# Altium project SpaceLiin_Satellite_4U_Laser_Internal_External_V1.0.0.PrjPcb
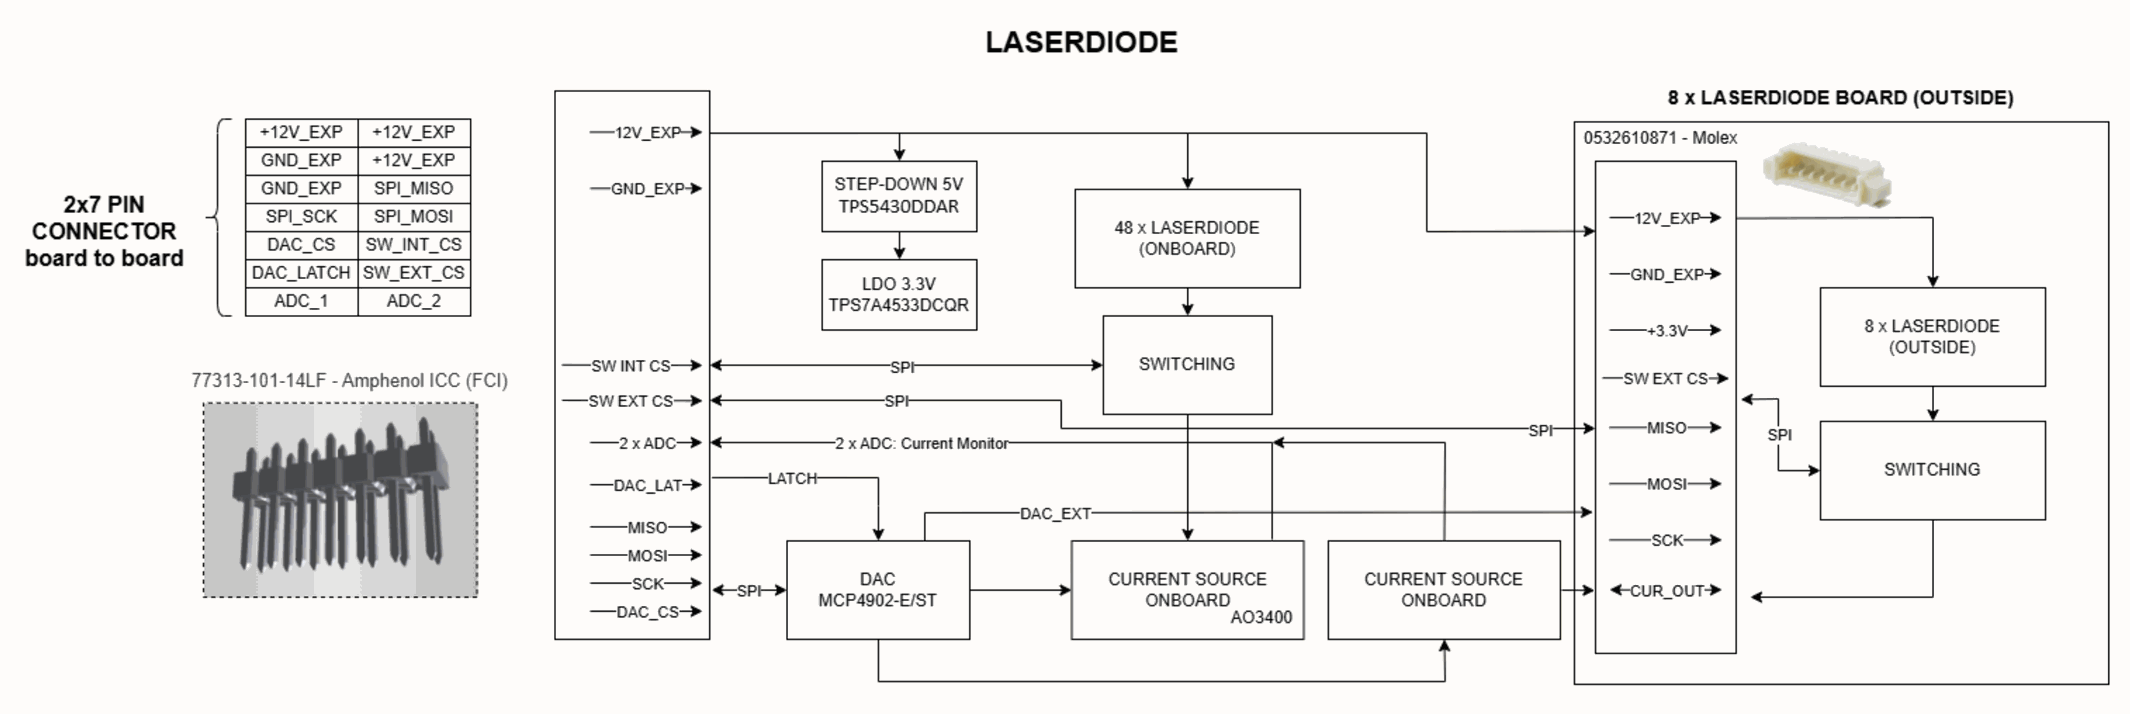
[diagram p0: 2_BLOCK_DIAGRAM.SchDoc]
6 sheets, 330 parts. Net scope: global (net labels, ports and power ports of the same name join across sheets).
Board files: LASER.PcbDoc, SpaceLiin_Satellite_4U_Laser_Internal_External_V1.0.0.PcbDoc
Sheets:
  2_BLOCK_DIAGRAM.SchDoc
  3_POWER SWITCH AND LDO.SchDoc
  4_COMMUNICATION.SchDoc
  5_CURRENT_SOURCE.SchDoc
  6_SWITCHING.SchDoc
  MOUNTING.SchDoc

## Sheet 2_BLOCK_DIAGRAM.SchDoc
size 420 x 297 mm; SheetNumber: 6; SheetTotal: 5

### Notes on the sheet
- Project:
- Sub-system:
- Design by:
- Sheet title:
- Sheet
- A3
- of
- Checked by:
- Approved by:
- Revision:
- Document No:
- Size:
- Date:

## Sheet 3_POWER SWITCH AND LDO.SchDoc
size 420 x 297 mm; SheetNumber: 3; SheetTotal: 7
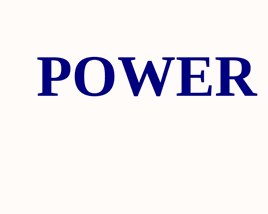
[diagram p1: 3_POWER SWITCH AND LDO.SchDoc, top left]
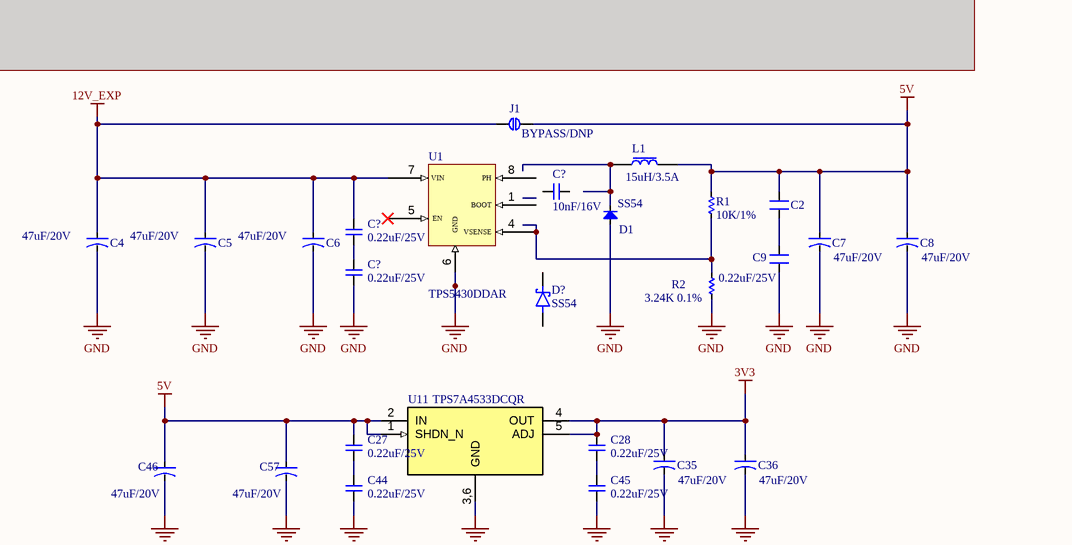
[diagram p2: 3_POWER SWITCH AND LDO.SchDoc, top right]
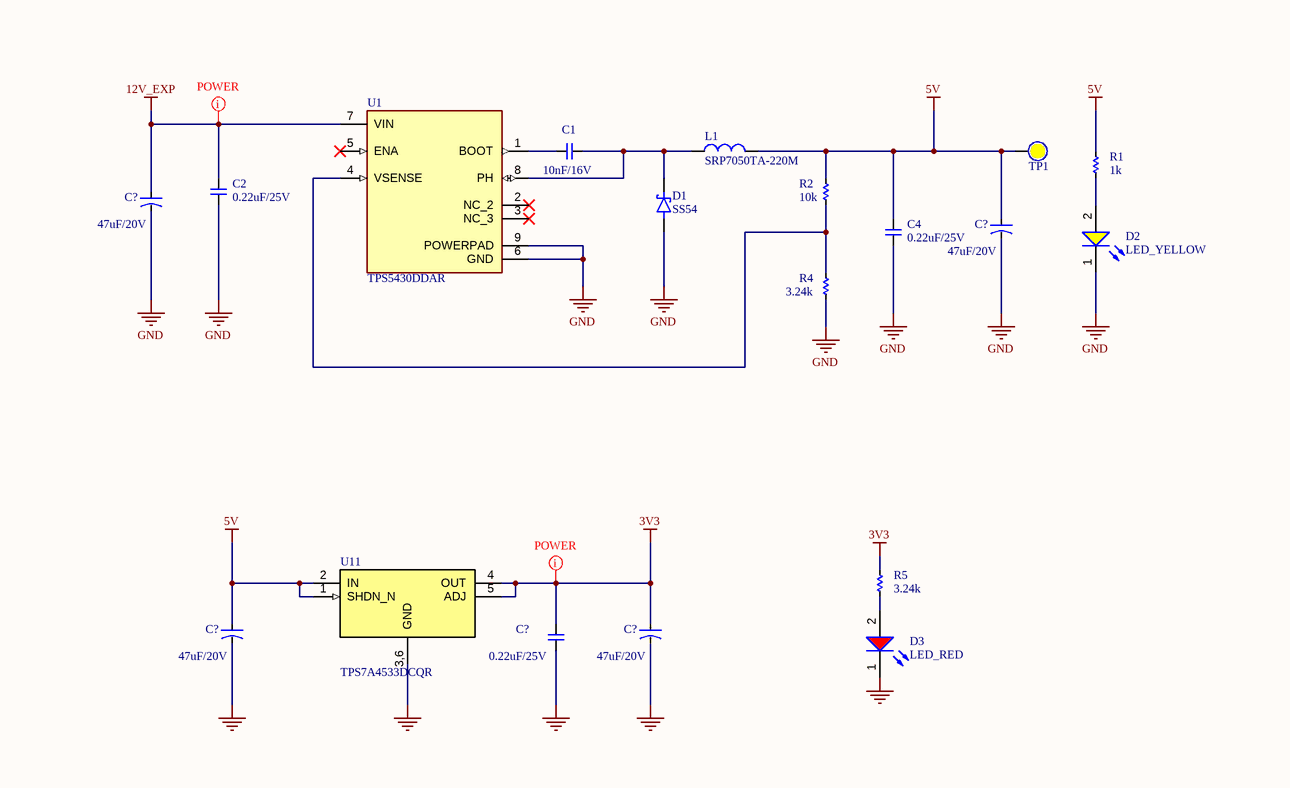
[diagram p3: 3_POWER SWITCH AND LDO.SchDoc, bottom right]

### Parts
(Parts that share a designator on the sheet are numbered #1, #2 ... from top to bottom, then left to right.)
C1  10nF/16V  [CAP_C_1005X50_L]
C2#1  0.22uF/25V  [SM-0603]  (value not drawn)
C2#2  0.22uF/25V  [CAP_C_1608X80]
C4#1  47uF/20V  [CAP TANT 2312]
C4#2  0.22uF/25V  [CAP_C_1608X80]
C5  47uF/20V  [CAP TANT 2312]
C6  47uF/20V  [CAP TANT 2312]
C7  47uF/20V  [CAP TANT 2312]
C8  47uF/20V  [CAP TANT 2312]
C9#1  0.22uF/25V  [SM-0603]
C27  0.22uF/25V  [CAP_C_1608X80]
C28  0.22uF/25V  [CAP_C_1608X80]
C35  47uF/20V  [CAP TANT 2312]
C36  47uF/20V  [CAP TANT 2312]
C44#1  0.22uF/25V  [CAP_C_1608X80]
C45  0.22uF/25V  [CAP_C_1608X80]
C46  47uF/20V  [CAP TANT 2312]
C57  47uF/20V  [CAP TANT 2312]
C?#1  10nF/16V  [CAP_C_1608X80]
C?#2  0.22uF/25V  [CAP_C_1608X80]
C?#3  0.22uF/25V  [CAP_C_1608X80]
C?#4  47uF/20V  [CAP TANT 2312]
C?#5  47uF/20V  [CAP TANT 2312]
C?#6  47uF/20V  [CAP TANT 2312]
C?#7  47uF/20V  [CAP TANT 2312]
C?#8  0.22uF/25V  [CAP_C_1608X80]
D1#1  SS54  [DIO-SMD-A]
D1#2  SS54  [DO-214AC_SMA]
D2  LED_YELLOW  [LED_0603]
D3  LED_RED  [LED_0603]
D?  SS54  [DO-214AC_SMA]
J1#1  BYPASS/DNP  [BIG_CONNECTOR]
L1#1  15uH/3.5A  [SRP7050TA]
L1#2  SRP7050TA-220M  [PSM6050]
R1#1  10K/1%  [RES-SMD-0603]
R1#2  1k  [RES_C_1005X40]
R2#1  3.24K 0.1%  [RES-SMD-0603]
R2#2  10k  [RES_C_1005x30_L]
R4  3.24k  [RES_C_1005x30_L]
R5  3.24k  [RES_C_1005X40]
TP1  (no value)  [Testpoint_50]  (no BOM)
U1#1  TPS5430DDAR  [HSOP8]
U1#2  TPS5430DDAR  [CONV_TPS5430DDAR]
U11#1  TPS7A4533DCQR  [SOT223-6]
U11#2  TPS7A4533DCQR  [SOT223-6]

### Nets
3V3: C28.2 C35.1 C36.1 C?#7.1 C?#8.2 R5.2 U11#1.4(OUT) U11#1.5(ADJ) U11#2.4(OUT) U11#2.5(ADJ)
5V: C2#1.2 C4#2.2 C7.1 C8.1 C27.2 C46.1 C57.1 C?#5.1 C?#6.1 J1#1.2 L1#1.2 L1#2.2 R1#1.2 R1#2.2 R2#2.2 TP1.1 U11#1.1(SHDN_N) U11#1.2(IN) U11#2.1(SHDN_N) U11#2.2(IN)
12V_EXP: C2#2.2 C4#1.1 C5.1 C6.1 C?#2.2 C?#4.1 J1#1.1 U1#1.7(VIN) U1#2.7(VIN)
GND: C2#2.1 C4#1.2 C4#2.1 C5.2 C6.2 C7.2 C8.2 C9#1.1 C35.2 C36.2 C44#1.1 C45.1 C46.2 C57.2 C?#3.1 C?#4.2 C?#5.2 C?#6.2 C?#7.2 C?#8.1 D1#1.1(A) D1#2.2(A) D2.1(K) D3.1(K) R2#1.1 R4.1 U1#1.6(GND) U1#2.6(GND) U1#2.9(POWERPAD) U11#1.3,6(GND) U11#2.3,6(GND)
NetC1_1: C1.1 D1#2.1(K) L1#2.1 U1#2.8(PH)
NetC1_2: C1.2 U1#2.1(BOOT)
NetC2#1_1: C2#1.1 C9#1.2
NetC27_1: C27.1 C44#1.2
NetC28_1: C28.1 C45.2
NetC?#2_1: C?#2.1 C?#3.2
NetD1#1_2: D1#1.2(K) L1#1.1
NetD2_2: D2.2(A) R1#2.1
NetD3_2: D3.2(A) R5.1
NetR1#1_1: R1#1.1 R2#1.2 U1#1.4(VSENSE)
NetR2#2_1: R2#2.1 R4.2 U1#2.4(VSENSE)

Not connected (* = marked no-connect by the designer): C?#1 1 2; D? 1(K) 2(A); U1#1 1(BOOT) 5(EN)* 8(PH); U1#2 2(NC_2)* 3(NC_3)* 5(ENA)*

### Layout directives
net class POWER: 3V3, 12V_EXP

### Notes on the sheet
- POWER SWITCH AND LDO
- Project:
- Sub-system:
- Design by:
- Sheet title:
- Sheet
- A3
- of
- Checked by:
- Approved by:
- Revision:
- Document No:
- Size:
- Date:

### Library data of the parts
C1 C2#2 C4#2 C27 C28 C44#1 C45 C?#1-C?#3 C?#8 = _CAP_C_2: CAP
C2#1 C9#1 = CM: CL10B224KA8NNNC; Value: 103
C4#1 C5-C8 C35 C36 C46 C57 C?#4-C?#7 = CN-ALU-SMD: TAJC476K020RNJ; Published: 8-Jun-2000; LatestRevisionDate: 17-Jul-2002; LatestRevisionNote: Re-released for DXP Platform.; PackageReference: POLAR0.8; Publisher: Altium Limited
D1#1 = Diode SMD: Code - JEDEC: DO-214-AB; Value: 1N5007; Published: 8-Jun-2000; Revision: July-2002: Re-released for DXP Platform.; Publisher: Altium Limited
D1#2 D? = DIODE SCHOTTKY
J1#1 = CNT: DNP
L1#1 = INDUCTOR: SRP7050TA-150M
L1#2 = SRP7050TA-220M: FIXED IND 22UH 2.5A 170 MOHM SMD
R1#1 = Res-SMD: ERJ-3EKF1002V; Manufacturer: Generic Components; Class: Passive; Published: 08/06/2000; Publisher: Altium Hobart Technology Centre
R1#2 R2#2 R4 R5 = _RES_B_2: RES
R2#1 = Res-SMD: ERJ-3EKF3241V; Manufacturer: Generic Components; Class: Passive; Published: 08/06/2000; Publisher: Altium Hobart Technology Centre
TP1 = Test Point: Solder: NF
U1#1 = TPS543X: pin to pad: 6>6+9
U1#2 = TPS5430DDAR: 5.5V to 36V Input, 3A, 500kHz Step-Down Converter; MF: Texas Instruments; Package: HSOIC-8 Texas Instruments; Check_prices: https://www.snapeda.com/parts/TPS5430DDAR/Texas+Instruments/view-part/?ref=eda; Value: *; Purchase-URL: https://pricing.snapeda.com/search/part/TPS5430DDAR/?ref=eda; Availability: In Stock; SnapEDA_Link: https://www.snapeda.com/parts/TPS5430DDAR/Texas+Instruments/view-part/?ref=snap; MP: TPS5430DDAR; Price: None

## Sheet 4_COMMUNICATION.SchDoc
size 420 x 297 mm; SheetNumber: 4; SheetTotal: 7
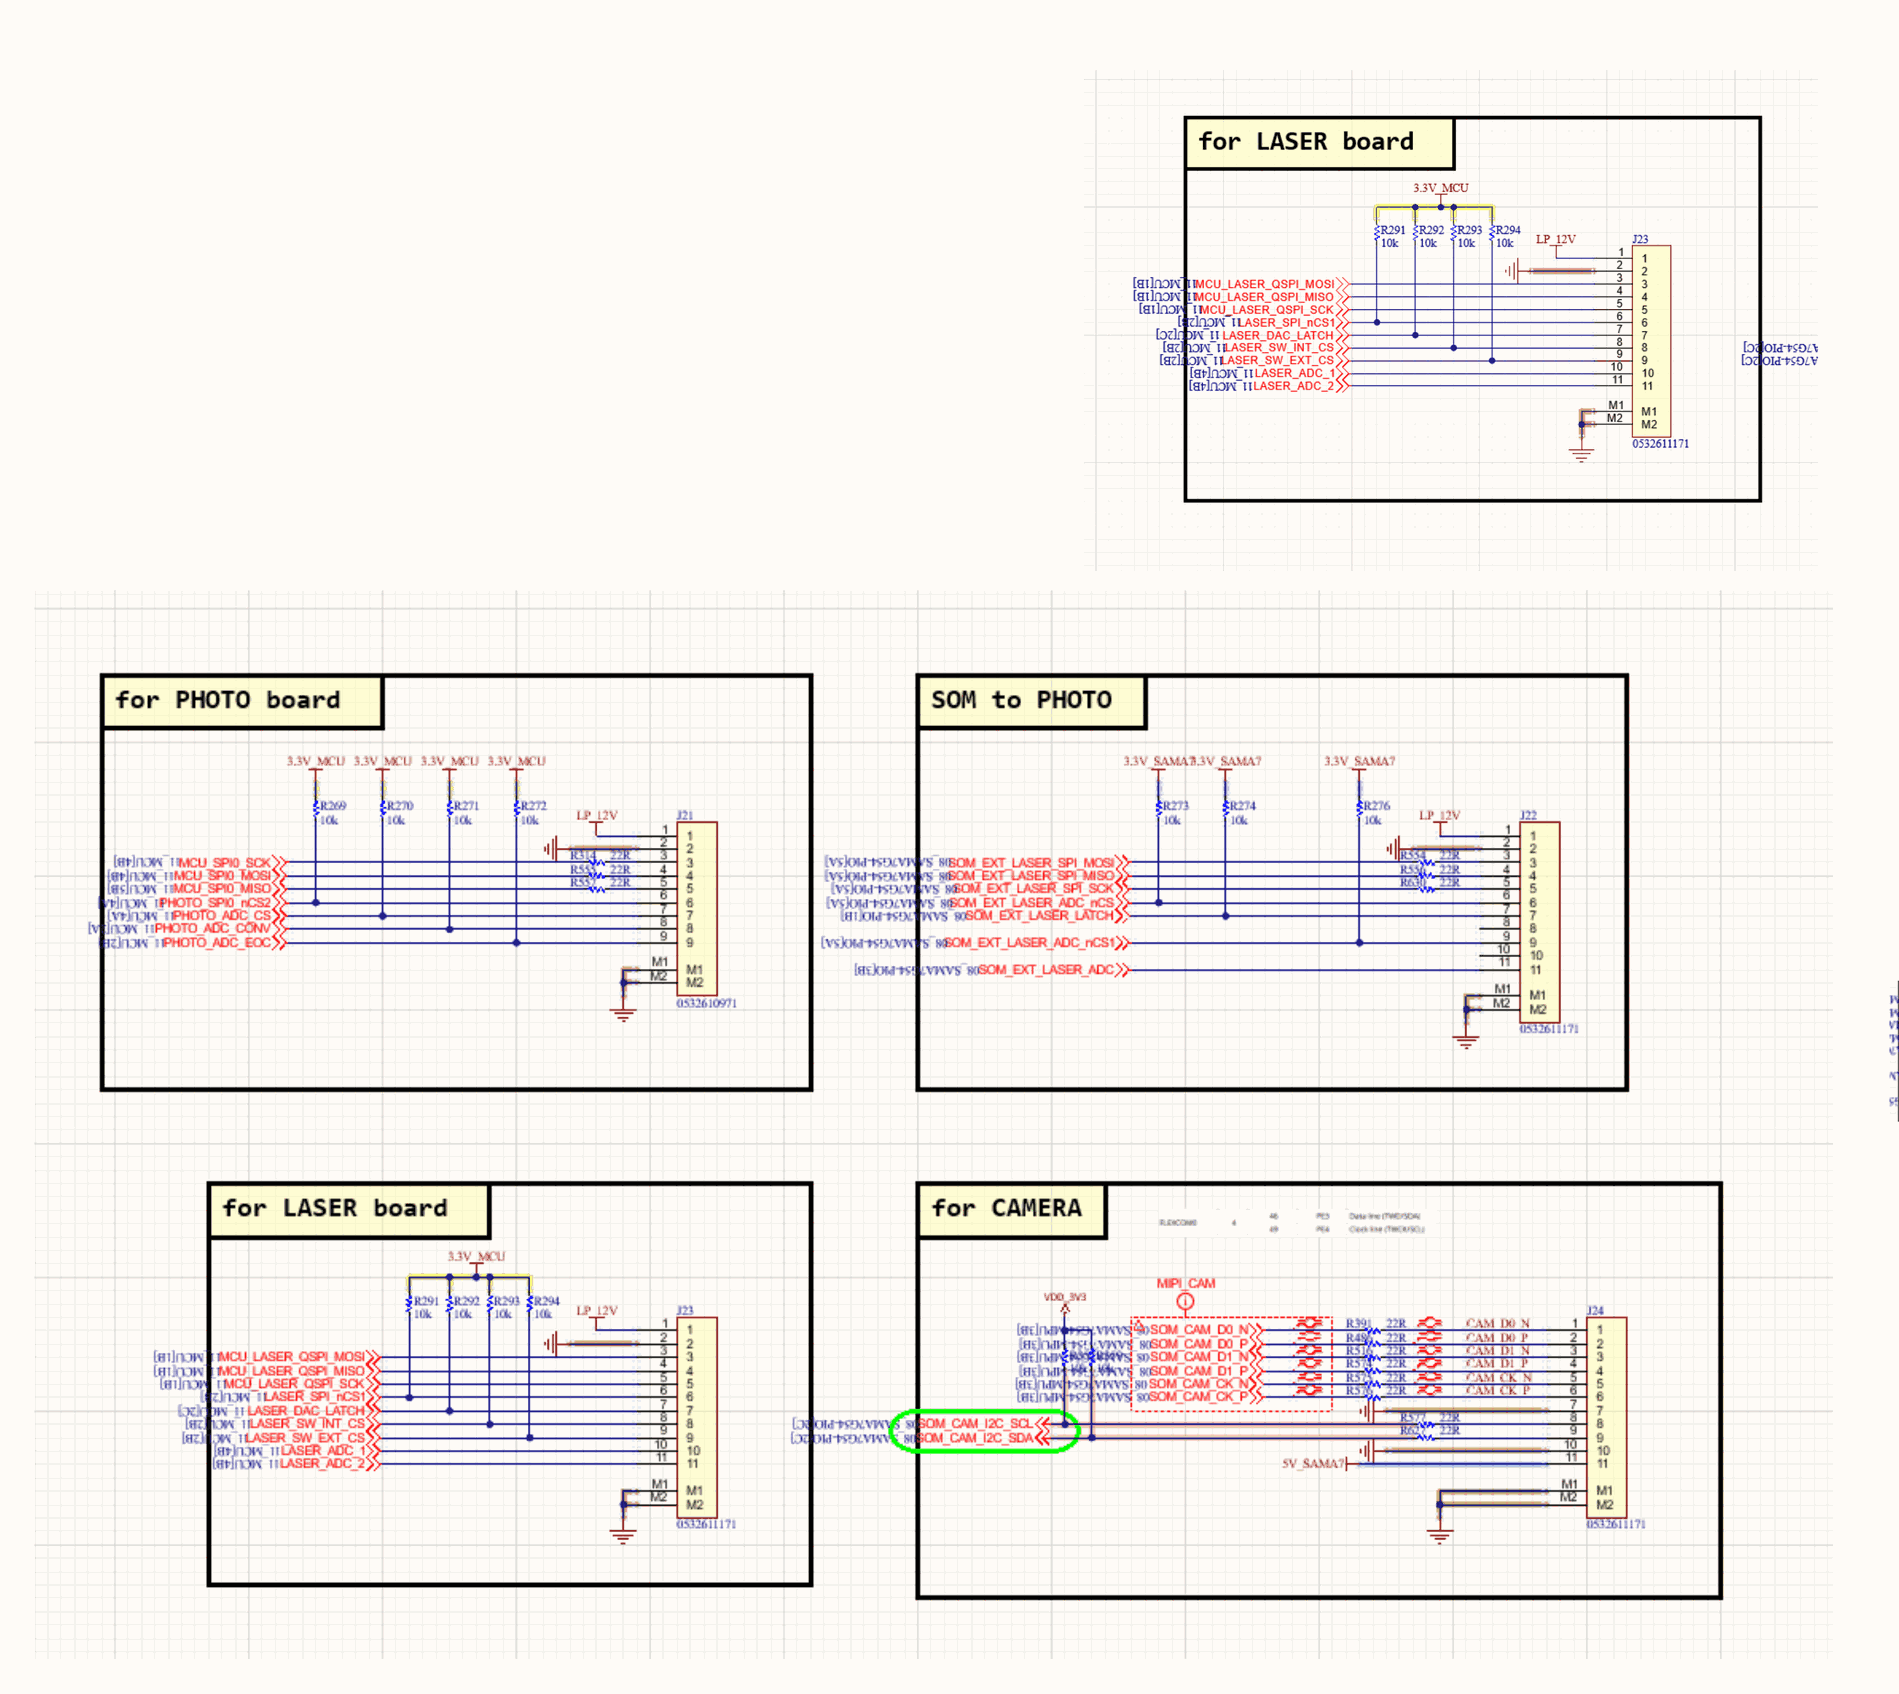
[diagram p4: 4_COMMUNICATION.SchDoc, left]
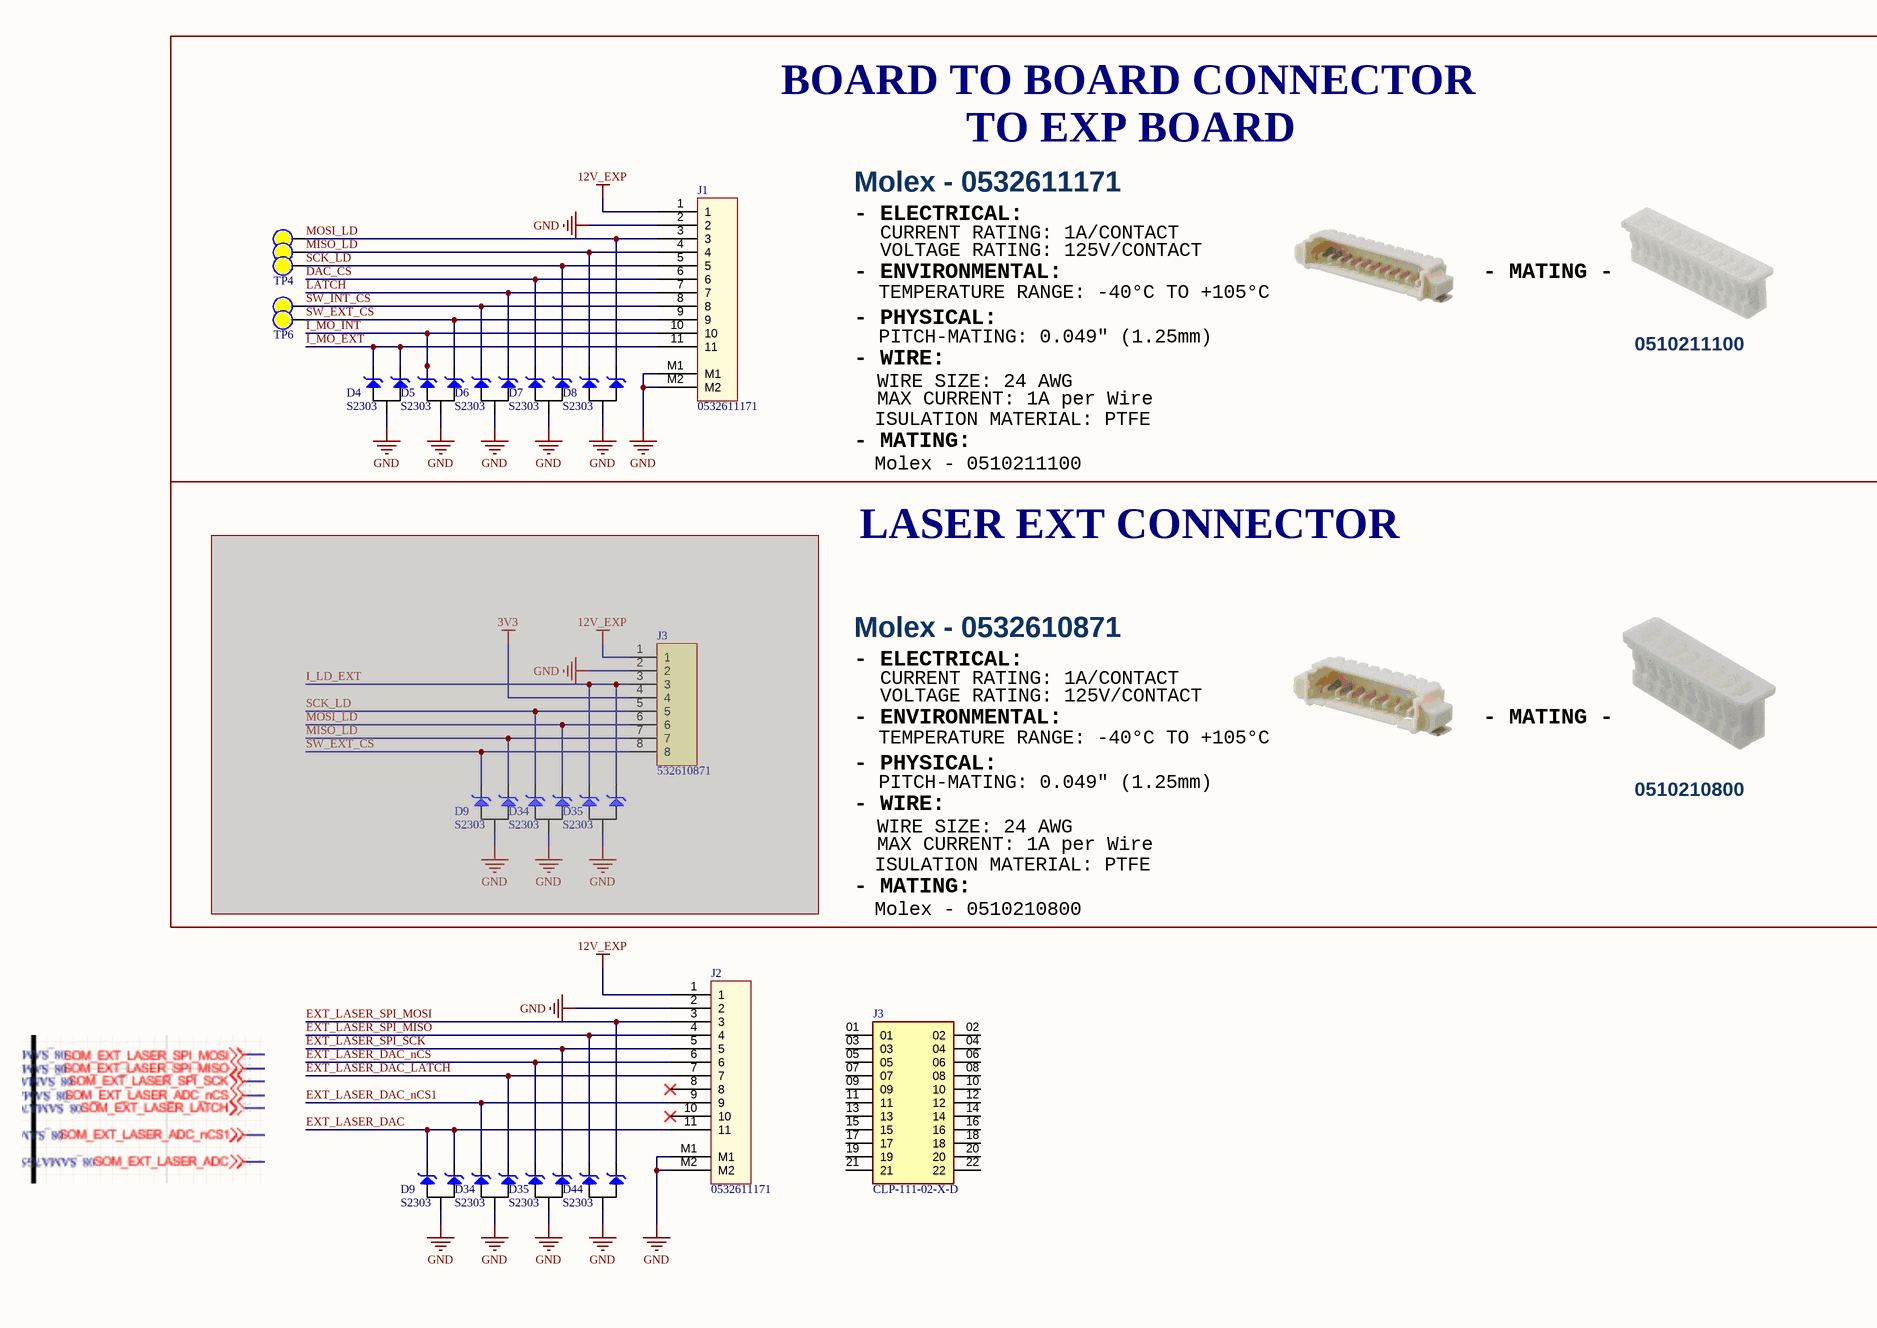
[diagram p5: 4_COMMUNICATION.SchDoc, right]

### Parts
(Parts that share a designator on the sheet are numbered #1, #2 ... from top to bottom, then left to right.)
D4  S2303  [SOT23-3-132]
D5  S2303  [SOT23-3-132]
D6  S2303  [SOT23-3-132]
D7  S2303  [SOT23-3-132]
D8  S2303  [SOT23-3-132]
D9#1  S2303  [SOT23-3-132]  (masked out: inside a compile mask, not in the netlist)
D9#2  S2303  [SOT23-3-132]
D34#1  S2303  [SOT23-3-132]  (masked out: inside a compile mask, not in the netlist)
D34#2  S2303  [SOT23-3-132]
D35#1  S2303  [SOT23-3-132]  (masked out: inside a compile mask, not in the netlist)
D35#2  S2303  [SOT23-3-132]
D44  S2303  [SOT23-3-132]
J1#2  0532611171  [MOLEX_0532611171]
J2  0532611171  [MOLEX_0532611171]
J3#1  532610871  [MOLEX_0532610871]  (masked out: inside a compile mask, not in the netlist)
J3#2  CLP-111-02-X-D  [SAMTEC_CLP-111-02-X-D]
TP2  (no value)  [Testpoint_50]  (no BOM)
TP3  (no value)  [Testpoint_50]  (no BOM)
TP4  (no value)  [Testpoint_50]  (no BOM)
TP5  (no value)  [Testpoint_50]  (no BOM)
TP6  (no value)  [Testpoint_50]  (no BOM)

### Blocks framed on the sheet
LASER EXT CONNECTOR: D9#1 D34#1 D35#1 J3#1

### Nets
12V_EXP: J1#2.1 J2.1
GND: D4.3 D5.3 D6.3 D7.3 D8.3 D9#2.3 D34#2.3 D35#2.3 D44.3 J1#2.2 J1#2.M1 J1#2.M2 J2.2 J2.M1 J2.M2
DAC_CS: D7.2 J1#2.6
EXT_LASER_DAC: D9#2.1 D9#2.2 J2.11
EXT_LASER_DAC_LATCH: D34#2.1 J2.7
EXT_LASER_DAC_nCS: D35#2.2 J2.6
EXT_LASER_DAC_nCS1: D34#2.2 J2.9
EXT_LASER_SPI_MISO: D44.2 J2.4
EXT_LASER_SPI_MOSI: D44.1 J2.3
EXT_LASER_SPI_SCK: D35#2.1 J2.5
I_MO_EXT: D4.1 D4.2 J1#2.11
I_MO_INT: D5.2 J1#2.10
LATCH: D6.1 J1#2.7
MISO_LD: D8.2 J1#2.4 TP3.1
MOSI_LD: D8.1 J1#2.3 TP2.1
SCK_LD: D7.1 J1#2.5 TP4.1
SW_EXT_CS: D5.1 J1#2.9 TP6.1
SW_INT_CS: D6.2 J1#2.8 TP5.1

Not connected (* = marked no-connect by the designer): J2 8* 10*; J3#2 01 02 03 04 05 06 07 08 09 10 11 12 13 14 15 16 17 18 19 20 21 22

### Notes on the sheet
- BOARD TO BOARD CONNECTOR
- Molex - 0532611171
- TO EXP BOARD
- - ELECTRICAL:
- CURRENT RATING: 1A/CONTACT
- VOLTAGE RATING: 125V/CONTACT
- - ENVIRONMENTAL:
- - PHYSICAL:
- TEMPERATURE RANGE: -40°C TO +105°C
- - MATING -
- - WIRE:
- WIRE SIZE: 24 AWG
- PITCH-MATING: 0.049" (1.25mm)
- 0510211100
- - MATING:
- ISULATION MATERIAL: PTFE
- Molex - 0510211100
- MAX CURRENT: 1A per Wire
- Molex - 0532610871
- 0510210800
- Molex - 0510210800
- Project:
- Sub-system:
- Design by:
- Sheet title:
- Sheet
- A3
- of
- Checked by:
- Approved by:
- Revision:
- Document No:
- Size:
- Date:

### Library data of the parts
J1#2 J2 = Header 11x1_2M
J3#1 = 532610871: Manufacturer_Name: Molex Connector Corporation; Copyright: Copyright (C) 2025 Ultra Librarian. All rights reserved.; Manufacturer_Part_Number: 532610871; Datasheet: https://www.molex.com/en-us/products/part-detail-pdf/532610871?display=pdf; RefDes: RefDes; Type: Type
J3#2 = CLP-111-02-X-D: CLP - Samtec 1.27mm Tiger Claw Rugged Reliable Dual Wipe Socket Strip; MP: CLP-111-02-L-D; SnapEDA_Link: https://www.snapeda.com/parts/CLP-111-02-L-D/Samtec/view-part/?ref=snap; Package: None; Value: *; MF: Samtec; Check_prices: https://www.snapeda.com/parts/CLP-111-02-L-D/Samtec/view-part/?ref=eda
TP2-TP6 = Test Point: Solder: NF

## Sheet 5_CURRENT_SOURCE.SchDoc
size 420 x 297 mm; SheetNumber: 5; SheetTotal: 7
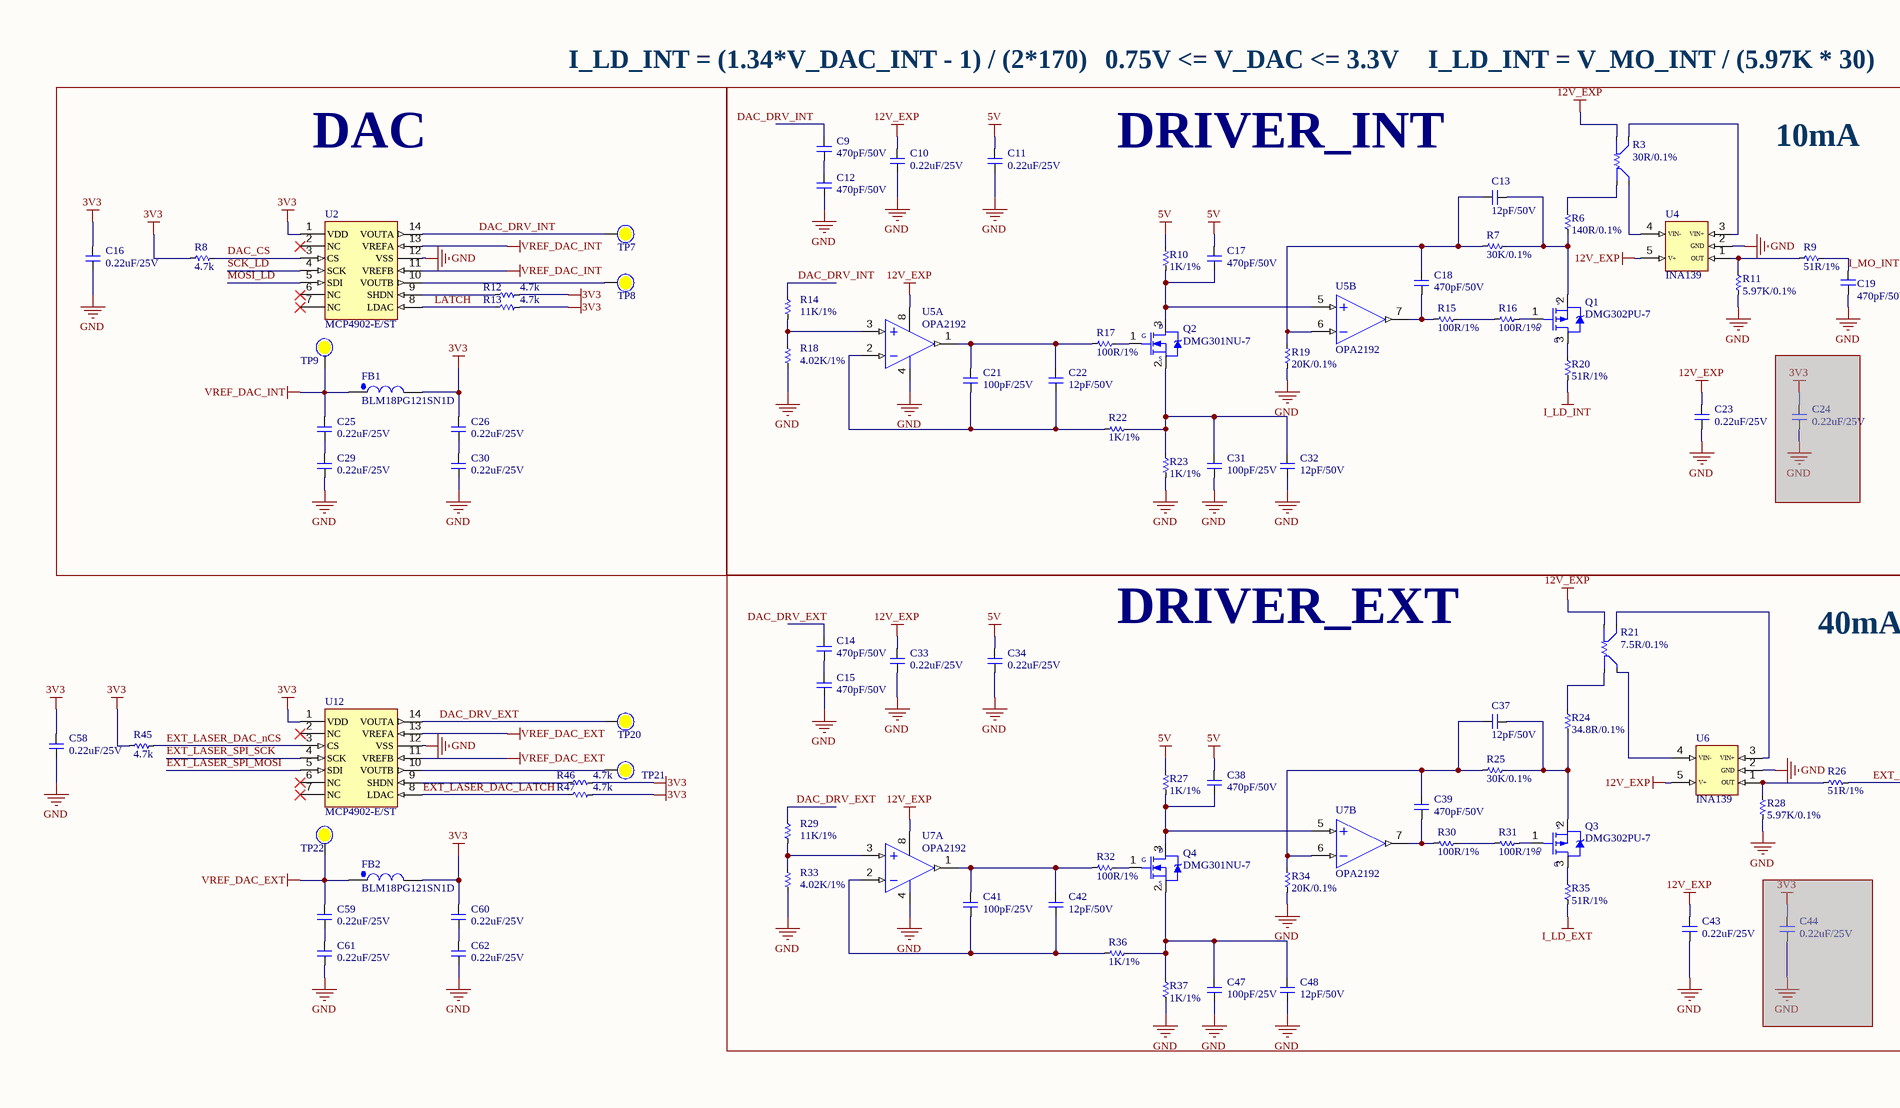
[diagram p6: 5_CURRENT_SOURCE.SchDoc, left]
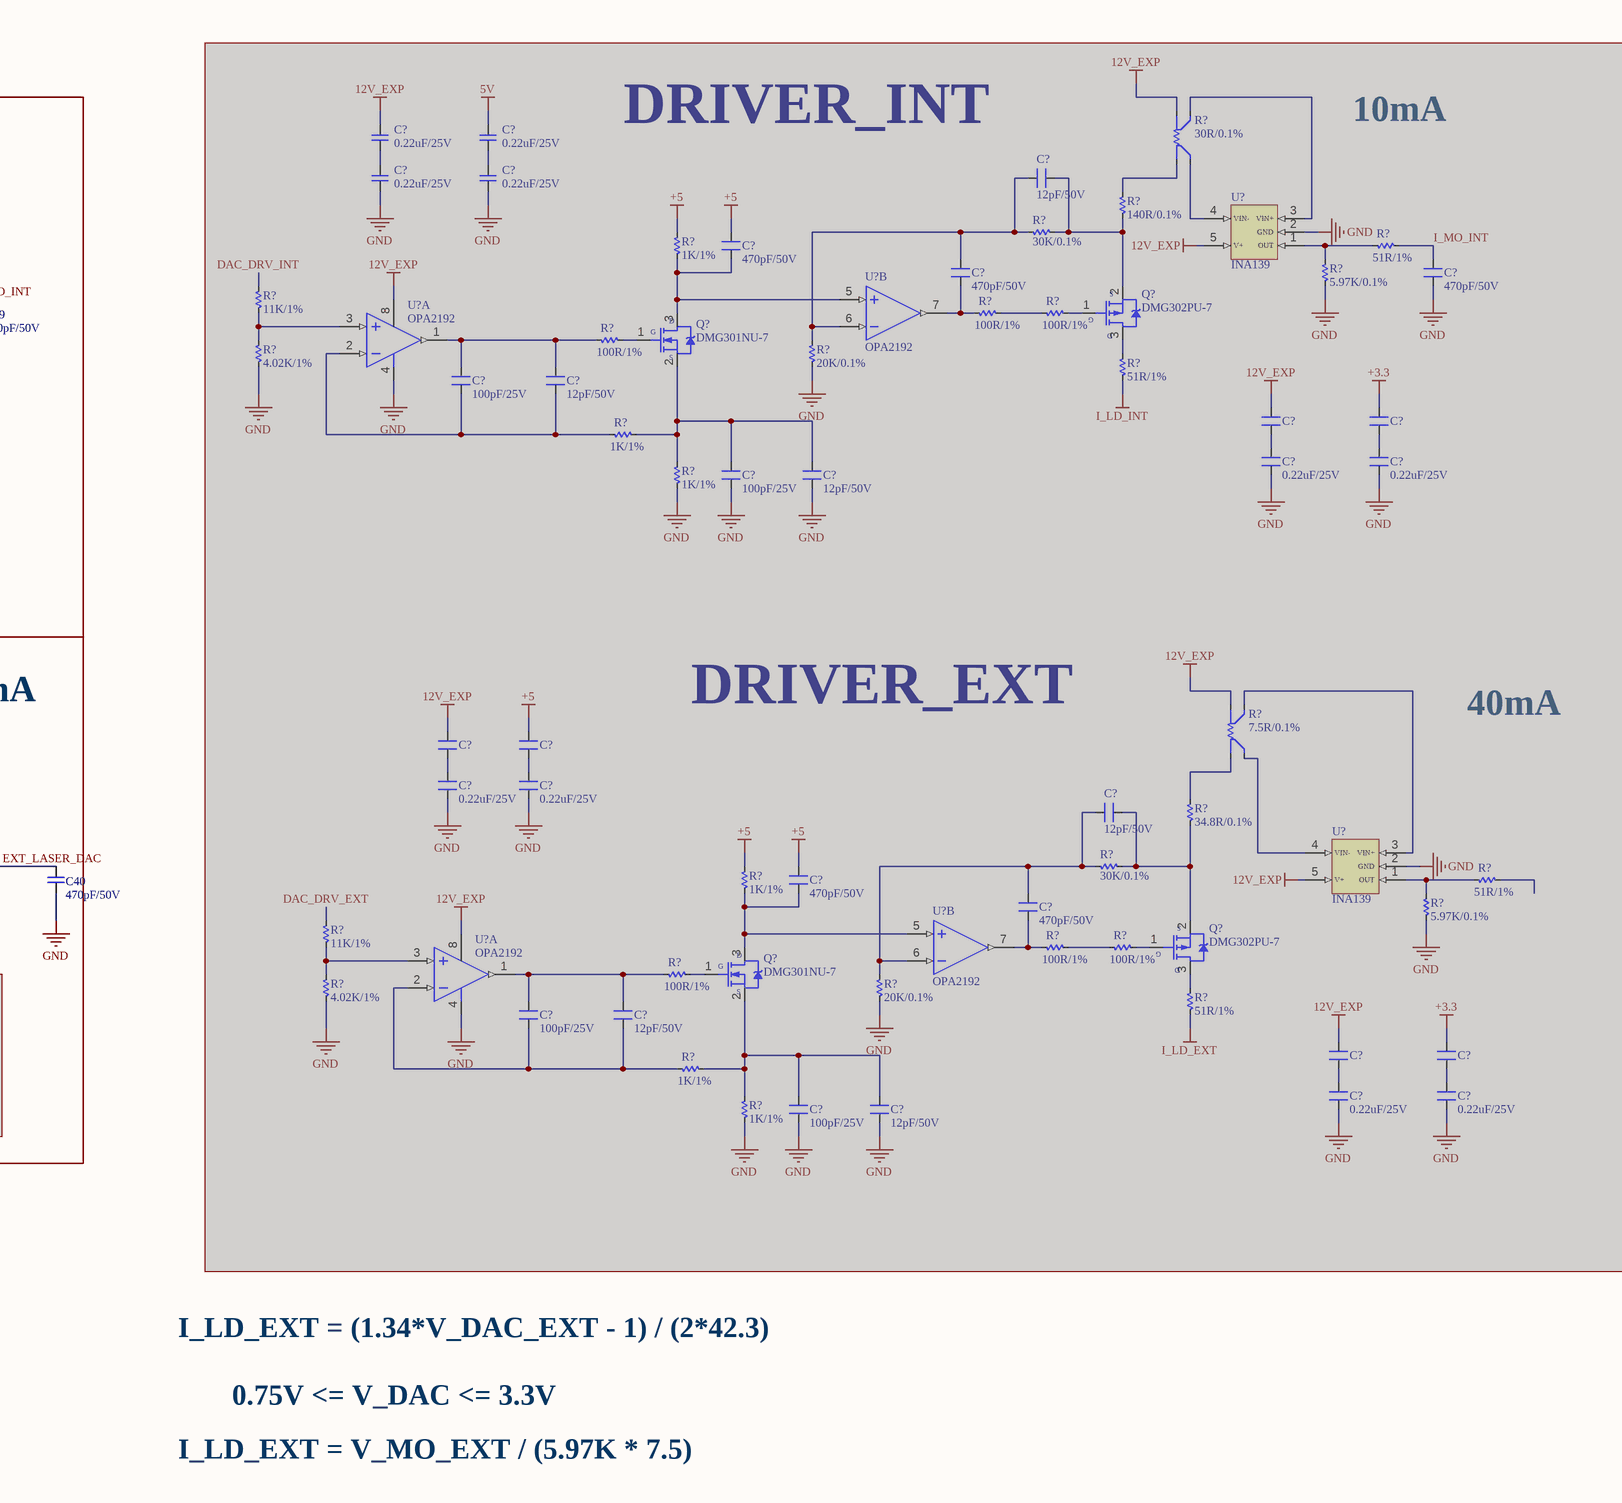
[diagram p7: 5_CURRENT_SOURCE.SchDoc, right]

### Parts
(Parts that share a designator on the sheet are numbered #1, #2 ... from top to bottom, then left to right.)
C9#2  470pF/50V  [CAP_C_1608X80]
C10  0.22uF/25V  [CAP_C_1608X80]
C11  0.22uF/25V  [CAP_C_1608X80]
C12  470pF/50V  [CAP_C_1608X80]
C13  12pF/50V  [CAP_C_1608X80]
C14  470pF/50V  [CAP_C_1608X80]
C15  470pF/50V  [CAP_C_1608X80]
C16  0.22uF/25V  [CAP_C_1608X80]
C17  470pF/50V  [CAP_C_1608X80]
C18  470pF/50V  [CAP_C_1608X80]
C19  470pF/50V  [CAP_C_1608X80]
C21  100pF/25V  [CAP_C_1608X80]
C22  12pF/50V  [CAP_C_1608X80]
C23  0.22uF/25V  [CAP_C_1608X80]
C24  0.22uF/25V  [CAP_C_1608X80]  (masked out: inside a compile mask, not in the netlist)
C25  0.22uF/25V  [CAP_C_1608X80]
C26  0.22uF/25V  [CAP_C_1608X80]
C29  0.22uF/25V  [CAP_C_1608X80]
C30  0.22uF/25V  [CAP_C_1608X80]
C31  100pF/25V  [CAP_C_1608X80]
C32  12pF/50V  [CAP_C_1608X80]
C33  0.22uF/25V  [CAP_C_1608X80]
C34  0.22uF/25V  [CAP_C_1608X80]
C37  12pF/50V  [CAP_C_1608X80]
C38  470pF/50V  [CAP_C_1608X80]
C39  470pF/50V  [CAP_C_1608X80]
C40  470pF/50V  [CAP_C_1608X80]
C41  100pF/25V  [CAP_C_1608X80]
C42  12pF/50V  [CAP_C_1608X80]
C43  0.22uF/25V  [CAP_C_1608X80]
C44#2  0.22uF/25V  [CAP_C_1608X80]  (masked out: inside a compile mask, not in the netlist)
C47  100pF/25V  [CAP_C_1608X80]
C48  12pF/50V  [CAP_C_1608X80]
C58  0.22uF/25V  [CAP_C_1608X80]
C59  0.22uF/25V  [CAP_C_1608X80]
C60  0.22uF/25V  [CAP_C_1608X80]
C61  0.22uF/25V  [CAP_C_1608X80]
C62  0.22uF/25V  [CAP_C_1608X80]
C?#9  0.22uF/25V  [CAP_C_1005X50_L]  (masked out: inside a compile mask, not in the netlist)
C?#10  0.22uF/25V  [CAP_C_1005X50_L]  (masked out: inside a compile mask, not in the netlist)
C?#11  0.22uF/25V  [CAP_C_1005X50_L]  (masked out: inside a compile mask, not in the netlist)
C?#12  0.22uF/25V  [CAP_C_1005X50_L]  (masked out: inside a compile mask, not in the netlist)
C?#13  12pF/50V  [SM-0603]  (masked out: inside a compile mask, not in the netlist)
C?#14  470pF/50V  [SM-0603]  (masked out: inside a compile mask, not in the netlist)
C?#15  470pF/50V  [SM-0603]  (masked out: inside a compile mask, not in the netlist)
C?#16  470pF/50V  [SM-0603]  (masked out: inside a compile mask, not in the netlist)
C?#17  100pF/25V  [SM-0603]  (masked out: inside a compile mask, not in the netlist)
C?#18  12pF/50V  [SM-0603]  (masked out: inside a compile mask, not in the netlist)
C?#19  0.22uF/25V  [SM-0603]  (value not drawn)  (masked out: inside a compile mask, not in the netlist)
C?#20  0.22uF/25V  [SM-0603]  (value not drawn)  (masked out: inside a compile mask, not in the netlist)
C?#21  0.22uF/25V  [SM-0603]  (masked out: inside a compile mask, not in the netlist)
C?#22  0.22uF/25V  [SM-0603]  (masked out: inside a compile mask, not in the netlist)
C?#23  100pF/25V  [SM-0603]  (masked out: inside a compile mask, not in the netlist)
C?#24  12pF/50V  [SM-0603]  (masked out: inside a compile mask, not in the netlist)
C?#25  0.22uF/25V  [SM-0603]  (value not drawn)  (masked out: inside a compile mask, not in the netlist)
C?#26  0.22uF/25V  [SM-0603]  (value not drawn)  (masked out: inside a compile mask, not in the netlist)
C?#27  0.22uF/25V  [SM-0603]  (masked out: inside a compile mask, not in the netlist)
C?#28  0.22uF/25V  [SM-0603]  (masked out: inside a compile mask, not in the netlist)
C?#29  12pF/50V  [SM-0603]  (masked out: inside a compile mask, not in the netlist)
C?#30  470pF/50V  [SM-0603]  (masked out: inside a compile mask, not in the netlist)
C?#31  470pF/50V  [SM-0603]  (masked out: inside a compile mask, not in the netlist)
C?#32  100pF/25V  [SM-0603]  (masked out: inside a compile mask, not in the netlist)
C?#33  12pF/50V  [SM-0603]  (masked out: inside a compile mask, not in the netlist)
C?#34  0.22uF/25V  [SM-0603]  (value not drawn)  (masked out: inside a compile mask, not in the netlist)
C?#35  0.22uF/25V  [SM-0603]  (value not drawn)  (masked out: inside a compile mask, not in the netlist)
C?#36  0.22uF/25V  [SM-0603]  (masked out: inside a compile mask, not in the netlist)
C?#37  0.22uF/25V  [SM-0603]  (masked out: inside a compile mask, not in the netlist)
C?#38  100pF/25V  [SM-0603]  (masked out: inside a compile mask, not in the netlist)
C?#39  12pF/50V  [SM-0603]  (masked out: inside a compile mask, not in the netlist)
FB1  BLM18PG121SN1D  [IND_C_1608X60]
FB2  BLM18PG121SN1D  [IND_C_1608X60]
Q1  DMG302PU-7  [SOT23-3-132]
Q2  DMG301NU-7  [SOT23-3-132]
Q3  DMG302PU-7  [SOT23-3-132]
Q4  DMG301NU-7  [SOT23-3-132]
Q?#1  DMG302PU-7  [SOT23-3-132]  (masked out: inside a compile mask, not in the netlist)
Q?#2  DMG301NU-7  [SOT23-3-132]  (masked out: inside a compile mask, not in the netlist)
Q?#3  DMG302PU-7  [SOT23-3-132]  (masked out: inside a compile mask, not in the netlist)
Q?#4  DMG301NU-7  [SOT23-3-132]  (masked out: inside a compile mask, not in the netlist)
R3  30R/0.1%  [RES_SMD_0603_SHUNT]
R6  140R/0.1%  [RES_C_1608X60]
R7  30K/0.1%  [RES_C_1608X60]
R8  4.7k  [RES_C_1608X60]
R9  51R/1%  [RES_C_1608X60]
R10  1K/1%  [RES_C_1608X60]
R11  5.97K/0.1%  [RES_C_1608X60]
R12  4.7k  [RES_C_1608X60]
R13  4.7k  [RES_C_1608X60]
R14  11K/1%  [RES_C_1608X60]
R15  100R/1%  [RES_C_1608X60]
R16  100R/1%  [RES_C_1608X60]
R17  100R/1%  [RES_C_1608X60]
R18  4.02K/1%  [RES_C_1608X60]
R19  20K/0.1%  [RES_C_1608X60]
R20  51R/1%  [RES_C_1608X60]
R21  7.5R/0.1%  [RES_SMD_0603_SHUNT]
R22  1K/1%  [RES_C_1608X60]
R23  1K/1%  [RES_C_1608X60]
R24  34.8R/0.1%  [RES_C_1608X60]
R25  30K/0.1%  [RES_C_1608X60]
R26  51R/1%  [RES_C_1608X60]
R27  1K/1%  [RES_C_1608X60]
R28  5.97K/0.1%  [RES_C_1608X60]
R29  11K/1%  [RES_C_1608X60]
R30  100R/1%  [RES_C_1608X60]
R31  100R/1%  [RES_C_1608X60]
R32  100R/1%  [RES_C_1608X60]
R33  4.02K/1%  [RES_C_1608X60]
R34  20K/0.1%  [RES_C_1608X60]
R35  51R/1%  [RES_C_1608X60]
R36  1K/1%  [RES_C_1608X60]
R37  1K/1%  [RES_C_1608X60]
R45  4.7k  [RES_C_1608X60]
R46  4.7k  [RES_C_1608X60]
R47  4.7k  [RES_C_1608X60]
R?#1  30R/0.1%  [RES_SMD_0603_SHUNT]  (masked out: inside a compile mask, not in the netlist)
R?#2  140R/0.1%  [RES-SMD-0603]  (masked out: inside a compile mask, not in the netlist)
R?#3  30K/0.1%  [RES-SMD-0603]  (masked out: inside a compile mask, not in the netlist)
R?#4  1K/1%  [RES-SMD-0603]  (masked out: inside a compile mask, not in the netlist)
R?#5  51R/1%  [RES-SMD-0603]  (masked out: inside a compile mask, not in the netlist)
R?#6  5.97K/0.1%  [RES-SMD-0603]  (masked out: inside a compile mask, not in the netlist)
R?#7  11K/1%  [RES-SMD-0603]  (masked out: inside a compile mask, not in the netlist)
R?#8  100R/1%  [RES-SMD-0603]  (masked out: inside a compile mask, not in the netlist)
R?#9  100R/1%  [RES-SMD-0603]  (masked out: inside a compile mask, not in the netlist)
R?#10  100R/1%  [RES-SMD-0603]  (masked out: inside a compile mask, not in the netlist)
R?#11  4.02K/1%  [RES-SMD-0603]  (masked out: inside a compile mask, not in the netlist)
R?#12  20K/0.1%  [RES-SMD-0603]  (masked out: inside a compile mask, not in the netlist)
R?#13  51R/1%  [RES-SMD-0603]  (masked out: inside a compile mask, not in the netlist)
R?#14  1K/1%  [RES-SMD-0603]  (masked out: inside a compile mask, not in the netlist)
R?#15  1K/1%  [RES-SMD-0603]  (masked out: inside a compile mask, not in the netlist)
R?#16  7.5R/0.1%  [RES_SMD_0603_SHUNT]  (masked out: inside a compile mask, not in the netlist)
R?#17  34.8R/0.1%  [RES-SMD-0603]  (masked out: inside a compile mask, not in the netlist)
R?#18  30K/0.1%  [RES-SMD-0603]  (masked out: inside a compile mask, not in the netlist)
R?#19  1K/1%  [RES-SMD-0603]  (masked out: inside a compile mask, not in the netlist)
R?#20  51R/1%  [RES-SMD-0603]  (masked out: inside a compile mask, not in the netlist)
R?#21  5.97K/0.1%  [RES-SMD-0603]  (masked out: inside a compile mask, not in the netlist)
R?#22  11K/1%  [RES-SMD-0603]  (masked out: inside a compile mask, not in the netlist)
R?#23  100R/1%  [RES-SMD-0603]  (masked out: inside a compile mask, not in the netlist)
R?#24  100R/1%  [RES-SMD-0603]  (masked out: inside a compile mask, not in the netlist)
R?#25  100R/1%  [RES-SMD-0603]  (masked out: inside a compile mask, not in the netlist)
R?#26  4.02K/1%  [RES-SMD-0603]  (masked out: inside a compile mask, not in the netlist)
R?#27  20K/0.1%  [RES-SMD-0603]  (masked out: inside a compile mask, not in the netlist)
R?#28  51R/1%  [RES-SMD-0603]  (masked out: inside a compile mask, not in the netlist)
R?#29  1K/1%  [RES-SMD-0603]  (masked out: inside a compile mask, not in the netlist)
R?#30  1K/1%  [RES-SMD-0603]  (masked out: inside a compile mask, not in the netlist)
TP7  (no value)  [Testpoint_50]  (no BOM)
TP8  (no value)  [Testpoint_50]  (no BOM)
TP9  (no value)  [Testpoint_50]  (no BOM)
TP20  (no value)  [Testpoint_50]  (no BOM)
TP21  (no value)  [Testpoint_50]  (no BOM)
TP22  (no value)  [Testpoint_50]  (no BOM)
U2  MCP4902-E/ST  [TSSOP14]
U4  INA139  [SOT23-5]
U5  OPA2192  [SO8]  (parts A,B of 2)
U6  INA139  [SOT23-5]
U7  OPA2192  [SO8]  (parts A,B of 2)
U12  MCP4902-E/ST  [TSSOP14]
U?#1  INA139  [SOT23-5]  (masked out: inside a compile mask, not in the netlist)
U?#2  OPA2192  [SO8]  (part B of 2)  (masked out: inside a compile mask, not in the netlist)
U?#3  OPA2192  [SO8]  (part A of 2)  (masked out: inside a compile mask, not in the netlist)
U?#4  INA139  [SOT23-5]  (masked out: inside a compile mask, not in the netlist)
U?#5  OPA2192  [SO8]  (part B of 2)  (masked out: inside a compile mask, not in the netlist)
U?#6  OPA2192  [SO8]  (part A of 2)  (masked out: inside a compile mask, not in the netlist)

### Blocks framed on the sheet
DAC: C16 C25 C26 C29 C30 FB1 R8 R12 R13 TP7-TP9 U2
DRIVER_INT: C9#2 C10-C13 C17-C19 C21-C24 C31 C32 Q1 Q2 R3 R6 R7 R9-R11 R14-R20 R22 R23 U4 U5
DRIVER_EXT: C14 C15 C33 C34 C37-C43 C44#2 C47 C48 Q3 Q4 R21 R24-R37 U6 U7

### Nets
3V3: C16.2 C26.2 C58.2 C60.2 FB1.2 FB2.2 R8.1 R12.2 R13.2 R45.1 R46.2 R47.2 U2.1(VDD) U12.1(VDD)
5V: C11.2 C17.2 C34.2 C38.2 R10.2 R27.2
12V_EXP: C10.2 C23.2 C33.2 C43.2 R3.1 R21.1 U4.5(V+) U5.8(+V) U6.5(V+) U7.8(+V)
GND: C10.1 C11.1 C12.1 C15.1 C16.1 C19.2 C23.1 C29.1 C30.1 C31.1 C32.1 C33.1 C34.1 C40.2 C43.1 C47.1 C48.1 C58.1 C61.1 C62.1 R11.2 R18.1 R19.1 R23.1 R28.2 R33.1 R34.1 R37.1 U2.12(VSS) U4.2(GND) U5.4(-V) U6.2(GND) U7.4(-V) U12.12(VSS)
I_LD_EXT: R35.1
I_LD_INT: R20.1
VREF_DAC_EXT: C59.2 FB2.1 TP22.1 U12.11(VREFB) U12.13(VREFA)
VREF_DAC_INT: C25.2 FB1.1 TP9.1 U2.11(VREFB) U2.13(VREFA)
DAC_CS: R8.2 U2.3(CS)
DAC_DRV_EXT: C14.2 R29.2 TP20.1 U12.14(VOUTA)
DAC_DRV_INT: C9#2.2 R14.2 TP7.1 U2.14(VOUTA)
EXT_LASER_DAC: C40.1 R26.2
EXT_LASER_DAC_LATCH: R47.1 U12.8(LDAC)
EXT_LASER_DAC_nCS: R45.2 U12.3(CS)
EXT_LASER_SPI_MOSI: U12.5(SDI)
EXT_LASER_SPI_SCK: U12.4(SCK)
I_MO_INT: C19.1 R9.2
LATCH: R13.1 U2.8(LDAC)
MOSI_LD: U2.5(SDI)
SCK_LD: U2.4(SCK)
NetC9#2_1: C9#2.1 C12.2
NetC13_1: C13.1 C18.2 R7.2 R19.2 U5.6(IN-)
NetC13_2: C13.2 Q1.2(S) R6.1 R7.1
NetC14_1: C14.1 C15.2
NetC17_1: C17.1 Q2.3(D) R10.1 U5.5(IN+)
NetC18_1: C18.1 R15.2 U5.7(OUT)
NetC21_1: C21.1 C22.1 R22.2 U5.2(IN-)
NetC21_2: C21.2 C22.2 R17.2 U5.1(OUT)
NetC25_1: C25.1 C29.2
NetC26_1: C26.1 C30.2
NetC31_2: C31.2 C32.2 Q2.2(S) R22.1 R23.2
NetC37_1: C37.1 C39.2 R25.2 R34.2 U7.6(IN-)
NetC37_2: C37.2 Q3.2(S) R24.1 R25.1
NetC38_1: C38.1 Q4.3(D) R27.1 U7.5(IN+)
NetC39_1: C39.1 R30.2 U7.7(OUT)
NetC41_1: C41.1 C42.1 R36.2 U7.2(IN-)
NetC41_2: C41.2 C42.2 R32.2 U7.1(OUT)
NetC47_2: C47.2 C48.2 Q4.2(S) R36.1 R37.2
NetC59_1: C59.1 C61.2
NetC60_1: C60.1 C62.2
NetQ1_1: Q1.1(G) R16.1
NetQ1_3: Q1.3(D) R20.2
NetQ2_1: Q2.1(G) R17.1
NetQ3_1: Q3.1(G) R31.1
NetQ3_3: Q3.3(D) R35.2
NetQ4_1: Q4.1(G) R32.1
NetR3_2: R3.2 R6.2
NetR3_3: R3.3 U4.3(VIN+)
NetR3_4: R3.4 U4.4(VIN-)
NetR9_1: R9.1 R11.1 U4.1(OUT)
NetR12_1: R12.1 U2.9(SHDN)
NetR14_1: R14.1 R18.2 U5.3(IN+)
NetR15_1: R15.1 R16.2
NetR21_2: R21.2 R24.2
NetR21_3: R21.3 U6.3(VIN+)
NetR21_4: R21.4 U6.4(VIN-)
NetR26_1: R26.1 R28.1 U6.1(OUT)
NetR29_1: R29.1 R33.2 U7.3(IN+)
NetR30_1: R30.1 R31.2
NetR46_1: R46.1 U12.9(SHDN)
NetTP8_1: TP8.1 U2.10(VOUTB)
NetTP21_1: TP21.1 U12.10(VOUTB)

Not connected (* = marked no-connect by the designer): U2 2(NC)* 6(NC)* 7(NC)*; U12 2(NC)* 6(NC)* 7(NC)*

### Notes on the sheet
- I_LD_INT = (1.34*V_DAC_INT - 1) / (2*170)
- 0.75V <= V_DAC <= 3.3V
- I_LD_INT = V_MO_INT / (5.97K * 30)
- 10mA
- DRIVER_INT
- 40mA
- DRIVER_EXT
- I_LD_EXT = (1.34*V_DAC_EXT - 1) / (2*42.3)
- I_LD_EXT = V_MO_EXT / (5.97K * 7.5)
- Project:
- Sub-system:
- Design by:
- Sheet title:
- Sheet
- A3
- of
- Checked by:
- Approved by:
- Revision:
- Document No:
- Size:
- Date:

### Library data of the parts
C9#2 C10-C19 C21-C26 C29-C34 C37-C43 C44#2 C47 C48 C58-C62 C?#9-C?#12 = _CAP_C_2: CAP
C?#13 C?#18 C?#24 C?#29 C?#33 C?#39 = CM: CL10C120JB81PNC; Value: 103
C?#14-C?#16 C?#30 C?#31 = CM: CL10B471KB8NNNC; Value: 103
C?#17 C?#23 C?#32 C?#38 = CM: C0603C101M3HACTU; Value: 103
C?#19-C?#22 C?#25-C?#28 C?#34-C?#37 = CM: CL10B224KA8NNNC; Value: 103
FB1 FB2 = _IND
Q1 Q3 Q?#1 Q?#3 = P_MOSFET
Q2 Q4 Q?#2 Q?#4 = N_MOSFET
R3 R?#1 = RES_SMD_SHUNT: RN73R1JTTD30R0B25
R6-R20 R22-R37 R45-R47 = _RES_B_2: RES
R21 R?#16 = RES_SMD_SHUNT: RT0603BRD077R5L
R?#2 = Res-SMD: ERA-3AEB1400V; Manufacturer: Generic Components; Class: Passive; Published: 08/06/2000; Publisher: Altium Hobart Technology Centre
R?#3 R?#18 = Res-SMD: ERA-3AEB303V; Manufacturer: Generic Components; Class: Passive; Published: 08/06/2000; Publisher: Altium Hobart Technology Centre
R?#4 R?#14 R?#15 R?#19 R?#29 R?#30 = Res-SMD: ERJ-3EKF1001V; Manufacturer: Generic Components; Class: Passive; Published: 08/06/2000; Publisher: Altium Hobart Technology Centre
R?#5 R?#13 R?#20 R?#28 = Res-SMD: ERJ-3EKF51R0V; Manufacturer: Generic Components; Class: Passive; Published: 08/06/2000; Publisher: Altium Hobart Technology Centre
R?#6 R?#21 = Res-SMD: RN73R1JTTD5971B25; Manufacturer: Generic Components; Class: Passive; Published: 08/06/2000; Publisher: Altium Hobart Technology Centre
R?#7 R?#22 = Res-SMD: ERJ-3EKF1102V; Manufacturer: Generic Components; Class: Passive; Published: 08/06/2000; Publisher: Altium Hobart Technology Centre
R?#8-R?#10 R?#23-R?#25 = Res-SMD: ERJ-PA3D1000V; Manufacturer: Generic Components; Class: Passive; Published: 08/06/2000; Publisher: Altium Hobart Technology Centre
R?#11 R?#26 = Res-SMD: RC0603FR-074K02L; Manufacturer: Generic Components; Class: Passive; Published: 08/06/2000; Publisher: Altium Hobart Technology Centre
R?#12 R?#27 = Res-SMD: ERA-3AEB203V; Manufacturer: Generic Components; Class: Passive; Published: 08/06/2000; Publisher: Altium Hobart Technology Centre
R?#17 = Res-SMD: RN73R1JTTD34R8B25; Manufacturer: Generic Components; Class: Passive; Published: 08/06/2000; Publisher: Altium Hobart Technology Centre
TP7-TP9 TP20-TP22 = Test Point: Solder: NF
U2 U12 = MCP4902
U4 U6 U?#1 U?#4 = INA139: INA139NA/250
U5 U7 U?#2 U?#3 U?#5 U?#6 = LM358: OPA2192IDR; Value: LM358

## Sheet 6_SWITCHING.SchDoc
size 420 x 297 mm; SheetNumber: 6; SheetTotal: 7
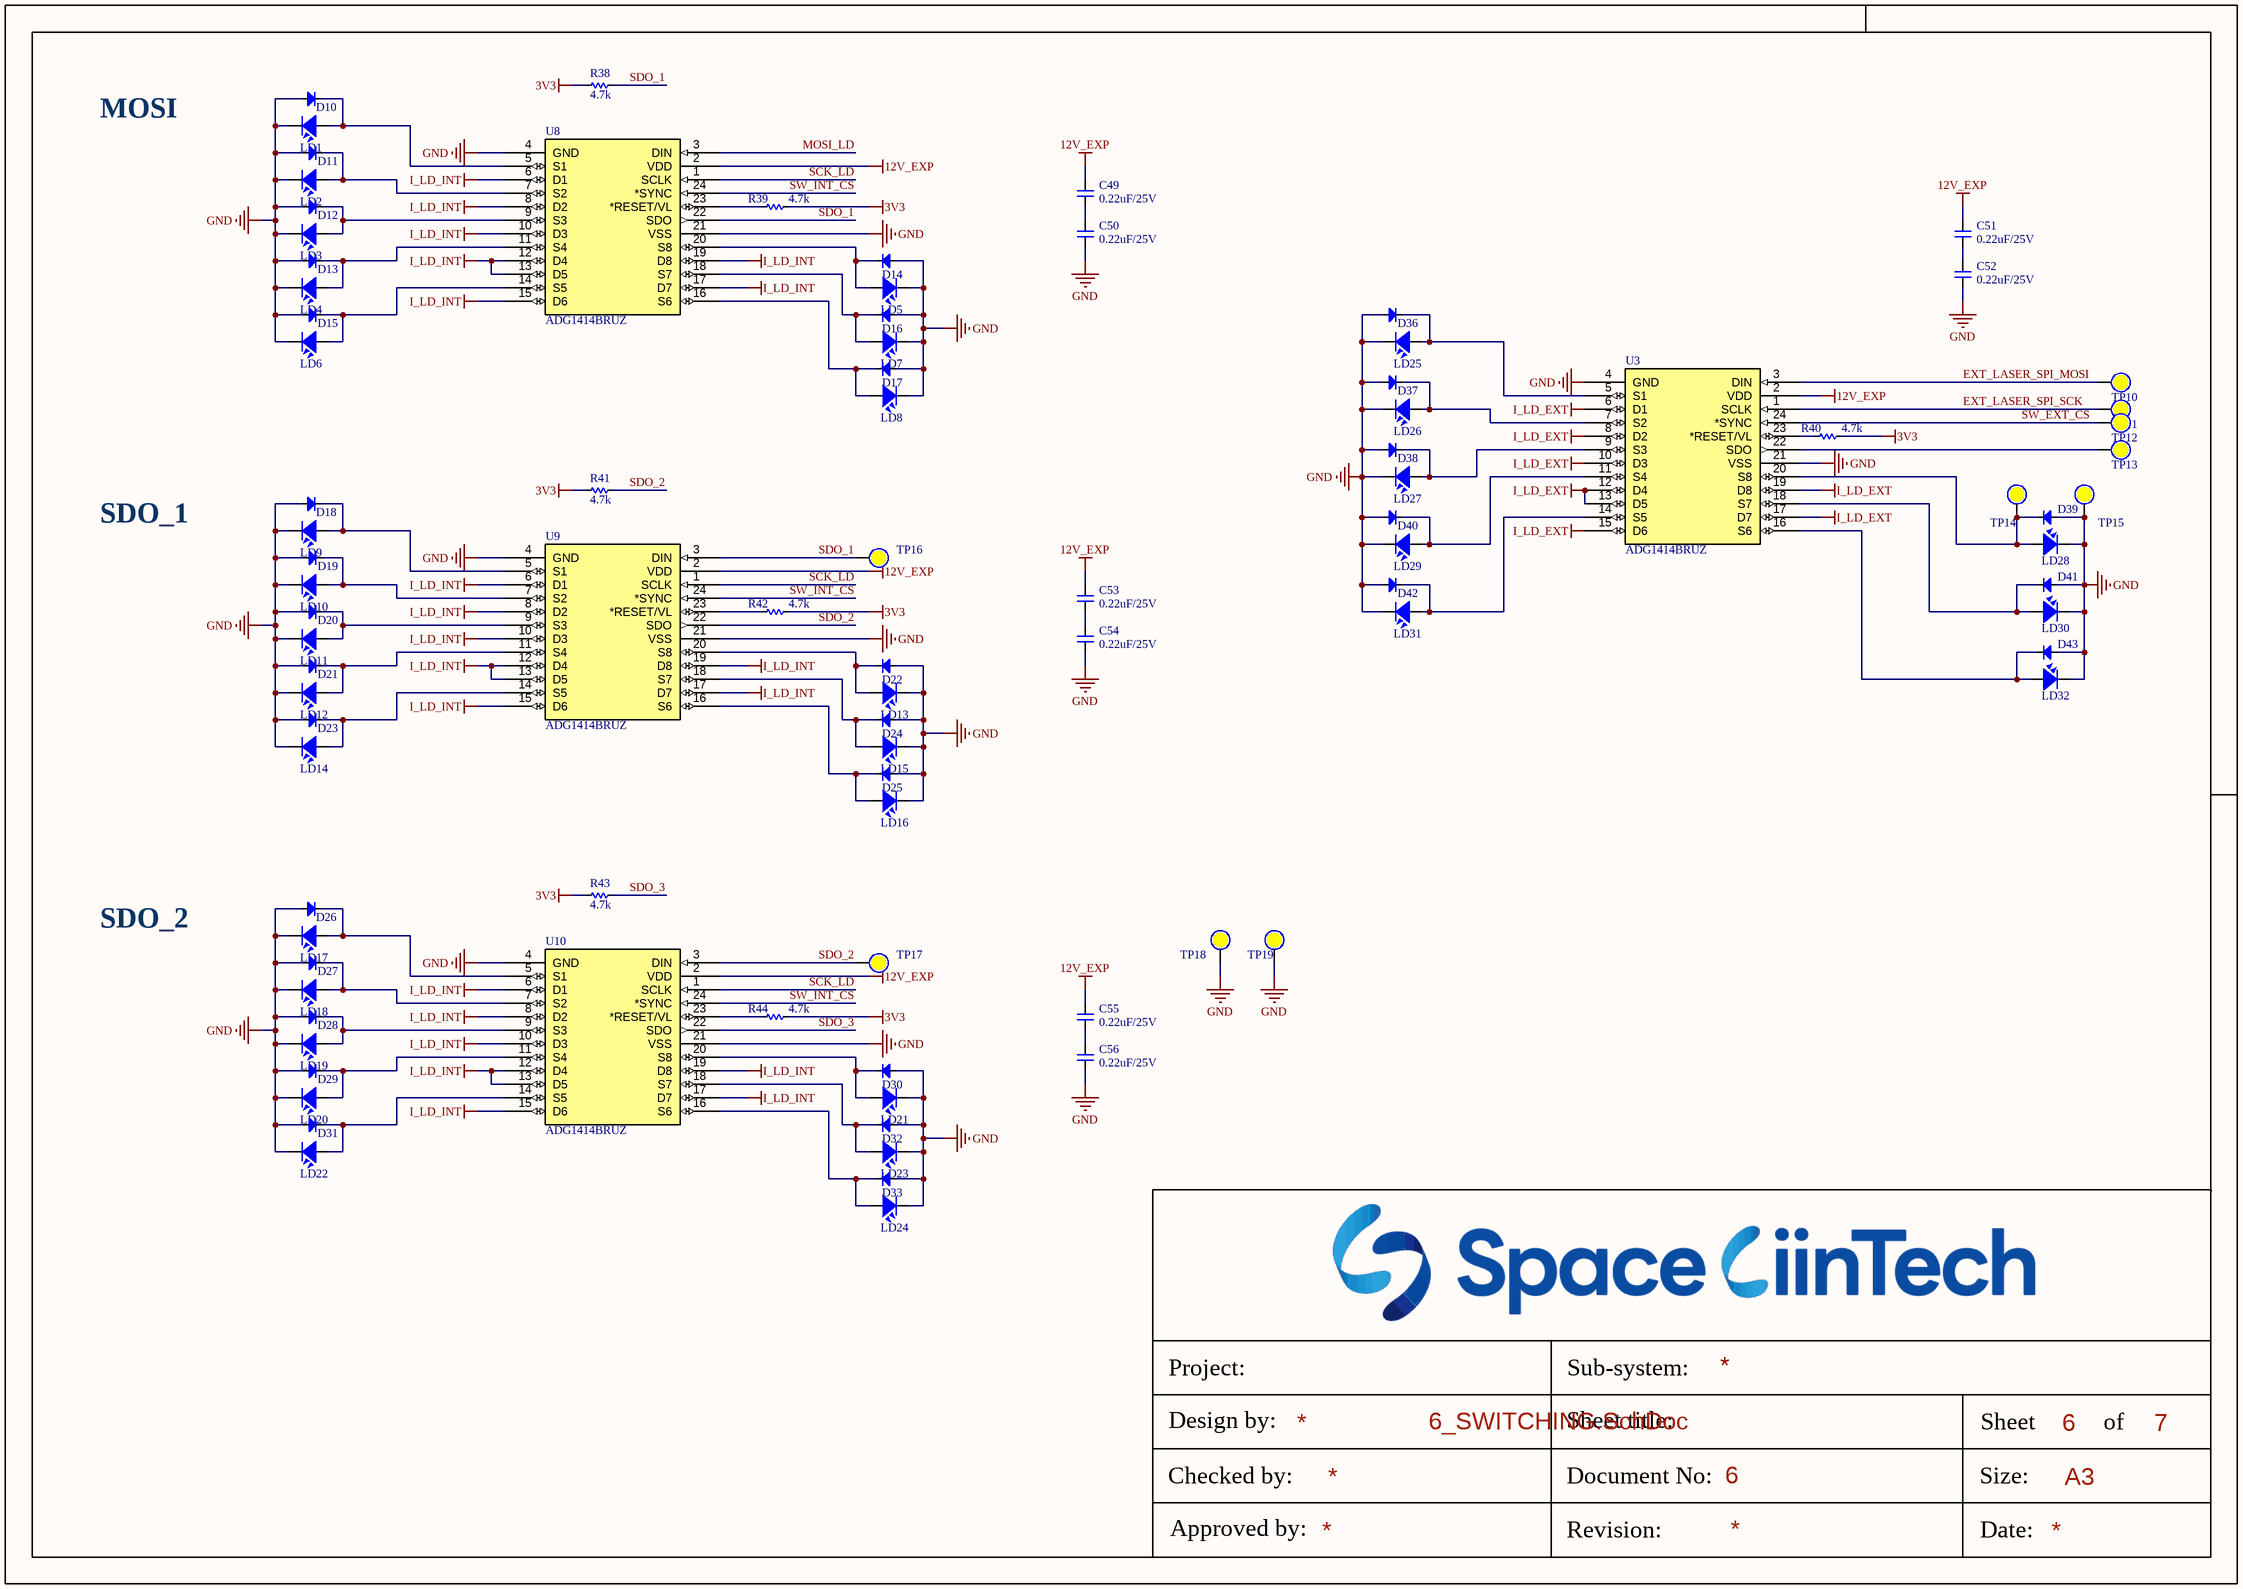
[diagram p8: 6_SWITCHING.SchDoc]

### Parts
C49  0.22uF/25V  [CAP_C_1608X80]
C50  0.22uF/25V  [CAP_C_1608X80]
C51  0.22uF/25V  [CAP_C_1608X80]
C52  0.22uF/25V  [CAP_C_1608X80]
C53  0.22uF/25V  [CAP_C_1608X80]
C54  0.22uF/25V  [CAP_C_1608X80]
C55  0.22uF/25V  [CAP_C_1608X80]
C56  0.22uF/25V  [CAP_C_1608X80]
D10  1N4148W-TP  [SOD23]  (value not drawn)
D11  1N4148W-TP  [SOD23]  (value not drawn)
D12  1N4148W-TP  [SOD23]  (value not drawn)
D13  1N4148W-TP  [SOD23]  (value not drawn)
D14  1N4148W-TP  [SOD23]  (value not drawn)
D15  1N4148W-TP  [SOD23]  (value not drawn)
D16  1N4148W-TP  [SOD23]  (value not drawn)
D17  1N4148W-TP  [SOD23]  (value not drawn)
D18  1N4148W-TP  [SOD23]  (value not drawn)
D19  1N4148W-TP  [SOD23]  (value not drawn)
D20  1N4148W-TP  [SOD23]  (value not drawn)
D21  1N4148W-TP  [SOD23]  (value not drawn)
D22  1N4148W-TP  [SOD23]  (value not drawn)
D23  1N4148W-TP  [SOD23]  (value not drawn)
D24  1N4148W-TP  [SOD23]  (value not drawn)
D25  1N4148W-TP  [SOD23]  (value not drawn)
D26  1N4148W-TP  [SOD23]  (value not drawn)
D27  1N4148W-TP  [SOD23]  (value not drawn)
D28  1N4148W-TP  [SOD23]  (value not drawn)
D29  1N4148W-TP  [SOD23]  (value not drawn)
D30  1N4148W-TP  [SOD23]  (value not drawn)
D31  1N4148W-TP  [SOD23]  (value not drawn)
D32  1N4148W-TP  [SOD23]  (value not drawn)
D33  1N4148W-TP  [SOD23]  (value not drawn)
D36  1N4148W-TP  [SOD23]  (value not drawn)
D37  1N4148W-TP  [SOD23]  (value not drawn)
D38  1N4148W-TP  [SOD23]  (value not drawn)
D39  1N4148W-TP  [SOD23]  (value not drawn)
D40  1N4148W-TP  [SOD23]  (value not drawn)
D41  1N4148W-TP  [SOD23]  (value not drawn)
D42  1N4148W-TP  [SOD23]  (value not drawn)
D43  1N4148W-TP  [SOD23]  (value not drawn)
LD1  LaserDiode  [OPV302]  (value not drawn)
LD2  LaserDiode  [OPV302]  (value not drawn)
LD3  LaserDiode  [OPV302]  (value not drawn)
LD4  LaserDiode  [OPV302]  (value not drawn)
LD5  LaserDiode  [OPV302]  (value not drawn)
LD6  LaserDiode  [OPV302]  (value not drawn)
LD7  LaserDiode  [OPV302]  (value not drawn)
LD8  LaserDiode  [OPV302]  (value not drawn)
LD9  LaserDiode  [OPV302]  (value not drawn)
LD10  LaserDiode  [OPV302]  (value not drawn)
LD11  LaserDiode  [OPV302]  (value not drawn)
LD12  LaserDiode  [OPV302]  (value not drawn)
LD13  LaserDiode  [OPV302]  (value not drawn)
LD14  LaserDiode  [OPV302]  (value not drawn)
LD15  LaserDiode  [OPV302]  (value not drawn)
LD16  LaserDiode  [OPV302]  (value not drawn)
LD17  LaserDiode  [OPV302]  (value not drawn)
LD18  LaserDiode  [OPV302]  (value not drawn)
LD19  LaserDiode  [OPV302]  (value not drawn)
LD20  LaserDiode  [OPV302]  (value not drawn)
LD21  LaserDiode  [OPV302]  (value not drawn)
LD22  LaserDiode  [OPV302]  (value not drawn)
LD23  LaserDiode  [OPV302]  (value not drawn)
LD24  LaserDiode  [OPV302]  (value not drawn)
LD25  LaserDiode  [RLD65NZX1]  (value not drawn)
LD26  LaserDiode  [RLD65NZX1]  (value not drawn)
LD27  LaserDiode  [RLD65NZX1]  (value not drawn)
LD28  LaserDiode  [RLD65NZX1]  (value not drawn)
LD29  LaserDiode  [RLD65NZX1]  (value not drawn)
LD30  LaserDiode  [RLD65NZX1]  (value not drawn)
LD31  LaserDiode  [RLD65NZX1]  (value not drawn)
LD32  LaserDiode  [RLD65NZX1]  (value not drawn)
R38  4.7k  [RES_C_1608X60]
R39  4.7k  [RES_C_1608X60]
R40  4.7k  [RES_C_1608X60]
R41  4.7k  [RES_C_1608X60]
R42  4.7k  [RES_C_1608X60]
R43  4.7k  [RES_C_1608X60]
R44  4.7k  [RES_C_1608X60]
TP10  (no value)  [Testpoint_50]  (no BOM)
TP11  (no value)  [Testpoint_50]  (no BOM)
TP12  (no value)  [Testpoint_50]  (no BOM)
TP13  (no value)  [Testpoint_50]  (no BOM)
TP14  (no value)  [Testpoint_50]  (no BOM)
TP15  (no value)  [Testpoint_50]  (no BOM)
TP16  (no value)  [Testpoint_50]  (no BOM)
TP17  (no value)  [Testpoint_50]  (no BOM)
TP18  (no value)  [Testpoint_50]  (no BOM)
TP19  (no value)  [Testpoint_50]  (no BOM)
U3  ADG1414BRUZ  [TSSOP24]
U8  ADG1414BRUZ  [TSSOP24]
U9  ADG1414BRUZ  [TSSOP24]
U10  ADG1414BRUZ  [TSSOP24]

### Nets
3V3: R38.1 R39.2 R40.2 R41.1 R42.2 R43.1 R44.2
12V_EXP: C49.2 C51.2 C53.2 C55.2 U3.2(VDD) U8.2(VDD) U9.2(VDD) U10.2(VDD)
GND: C50.1 C52.1 C54.1 C56.1 D10.1(A) D11.1(A) D12.1(A) D13.1(A) D14.1(A) D15.1(A) D16.1(A) D17.1(A) D18.1(A) D19.1(A) D20.1(A) D21.1(A) D22.1(A) D23.1(A) D24.1(A) D25.1(A) D26.1(A) D27.1(A) D28.1(A) D29.1(A) D30.1(A) D31.1(A) D32.1(A) D33.1(A) D36.1(A) D37.1(A) D38.1(A) D39.1(A) D40.1(A) D41.1(A) D42.1(A) D43.1(A) LD1.2 LD2.2 LD3.2 LD4.2 LD5.2 LD6.2 LD7.2 LD8.2 LD9.2 LD10.2 LD11.2 LD12.2 LD13.2 LD14.2 LD15.2 LD16.2 LD17.2 LD18.2 LD19.2 LD20.2 LD21.2 LD22.2 LD23.2 LD24.2 LD25.1 LD26.1 LD27.1 LD28.1 LD29.1 LD30.1 LD31.1 LD32.1 TP15.1 TP18.1 TP19.1 U3.4(GND) U3.21(VSS) U8.4(GND) U8.21(VSS) U9.4(GND) U9.21(VSS) U10.4(GND) U10.21(VSS)
I_LD_EXT: U3.6(D1) U3.8(D2) U3.10(D3) U3.12(D4) U3.13(D5) U3.15(D6) U3.17(D7) U3.19(D8)
I_LD_INT: U8.6(D1) U8.8(D2) U8.10(D3) U8.12(D4) U8.13(D5) U8.15(D6) U8.17(D7) U8.19(D8) U9.6(D1) U9.8(D2) U9.10(D3) U9.12(D4) U9.13(D5) U9.15(D6) U9.17(D7) U9.19(D8) U10.6(D1) U10.8(D2) U10.10(D3) U10.12(D4) U10.13(D5) U10.15(D6) U10.17(D7) U10.19(D8)
EXT_LASER_SPI_MOSI: TP10.1 U3.3(DIN)
EXT_LASER_SPI_SCK: TP11.1 U3.1(SCLK)
MOSI_LD: U8.3(DIN)
SCK_LD: U8.1(SCLK) U9.1(SCLK) U10.1(SCLK)
SDO_1: R38.2 TP16.1 U8.22(SDO) U9.3(DIN)
SDO_2: R41.2 TP17.1 U9.22(SDO) U10.3(DIN)
SDO_3: R43.2 U10.22(SDO)
SW_EXT_CS: TP12.1 U3.24(*SYNC)
SW_INT_CS: U8.24(*SYNC) U9.24(*SYNC) U10.24(*SYNC)
NetC49_1: C49.1 C50.2
NetC51_1: C51.1 C52.2
NetC53_1: C53.1 C54.2
NetC55_1: C55.1 C56.2
NetD10_2: D10.2(K) LD1.1 U8.5(S1)
NetD11_2: D11.2(K) LD2.1 U8.7(S2)
NetD12_2: D12.2(K) LD3.1 U8.9(S3)
NetD13_2: D13.2(K) LD4.1 U8.11(S4)
NetD14_2: D14.2(K) LD5.1 U8.20(S8)
NetD15_2: D15.2(K) LD6.1 U8.14(S5)
NetD16_2: D16.2(K) LD7.1 U8.18(S7)
NetD17_2: D17.2(K) LD8.1 U8.16(S6)
NetD18_2: D18.2(K) LD9.1 U9.5(S1)
NetD19_2: D19.2(K) LD10.1 U9.7(S2)
NetD20_2: D20.2(K) LD11.1 U9.9(S3)
NetD21_2: D21.2(K) LD12.1 U9.11(S4)
NetD22_2: D22.2(K) LD13.1 U9.20(S8)
NetD23_2: D23.2(K) LD14.1 U9.14(S5)
NetD24_2: D24.2(K) LD15.1 U9.18(S7)
NetD25_2: D25.2(K) LD16.1 U9.16(S6)
NetD26_2: D26.2(K) LD17.1 U10.5(S1)
NetD27_2: D27.2(K) LD18.1 U10.7(S2)
NetD28_2: D28.2(K) LD19.1 U10.9(S3)
NetD29_2: D29.2(K) LD20.1 U10.11(S4)
NetD30_2: D30.2(K) LD21.1 U10.20(S8)
NetD31_2: D31.2(K) LD22.1 U10.14(S5)
NetD32_2: D32.2(K) LD23.1 U10.18(S7)
NetD33_2: D33.2(K) LD24.1 U10.16(S6)
NetD36_2: D36.2(K) LD25.3 U3.5(S1)
NetD37_2: D37.2(K) LD26.3 U3.7(S2)
NetD38_2: D38.2(K) LD27.3 U3.9(S3)
NetD39_2: D39.2(K) LD28.3 TP14.1 U3.20(S8)
NetD40_2: D40.2(K) LD29.3 U3.11(S4)
NetD41_2: D41.2(K) LD30.3 U3.18(S7)
NetD42_2: D42.2(K) LD31.3 U3.14(S5)
NetD43_2: D43.2(K) LD32.3 U3.16(S6)
NetR39_1: R39.1 U8.23(*RESET/VL)
NetR40_1: R40.1 U3.23(*RESET/VL)
NetR42_1: R42.1 U9.23(*RESET/VL)
NetR44_1: R44.1 U10.23(*RESET/VL)
NetTP13_1: TP13.1 U3.22(SDO)

### Notes on the sheet
- MOSI
- SDO_1
- SDO_2
- Project:
- Sub-system:
- Design by:
- Sheet title:
- Sheet
- A3
- of
- Checked by:
- Approved by:
- Revision:
- Document No:
- Size:
- Date:

### Library data of the parts
C49-C56 = _CAP_C_2: CAP
D10-D33 D36-D43 = Diode SMD: Code - JEDEC: DO-214-AB; Value: 1N5007; Published: 8-Jun-2000; Revision: July-2002: Re-released for DXP Platform.; Publisher: Altium Limited
LD1-LD24 = LD: OPV302
LD25-LD32 = LD_RLD65NZX1: RLD65NZX1
R38-R44 = _RES_B_2: RES
TP10-TP19 = Test Point: Solder: NF

## Sheet MOUNTING.SchDoc
size 420 x 297 mm; SheetNumber: 7; SheetTotal: 7
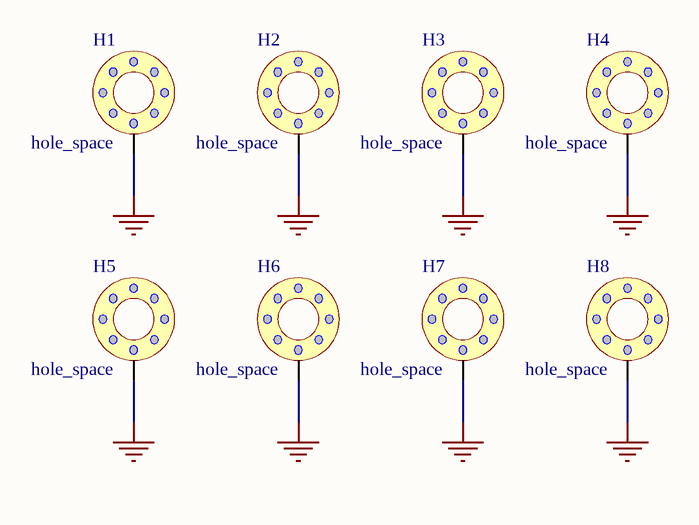
[diagram p9: MOUNTING.SchDoc]

### Parts
H1  hole_space  [HEX-M3_NoVia_Smaller]
H2  hole_space  [HEX-M3_NoVia_Smaller]
H3  hole_space  [HEX-M3_NoVia_Smaller]
H4  hole_space  [HEX-M3_NoVia_Smaller]
H5  hole_space  [HEX-M3_NoVia_Smaller]
H6  hole_space  [HEX-M3_NoVia_Smaller]
H7  hole_space  [HEX-M3_NoVia_Smaller]
H8  hole_space  [HEX-M3_NoVia_Smaller]

### Nets
GND: H1.1 H2.1 H3.1 H4.1 H5.1 H6.1 H7.1 H8.1

### Notes on the sheet
- Project:
- Sub-system:
- Design by:
- Sheet title:
- Sheet
- A3
- of
- Checked by:
- Approved by:
- Revision:
- Document No:
- Size:
- Date:

## Nets that join several sheets
3V3: 3_POWER SWITCH AND LDO (10 pins), 5_CURRENT_SOURCE (14 pins), 6_SWITCHING (7 pins)
5V: 3_POWER SWITCH AND LDO (20 pins), 5_CURRENT_SOURCE (6 pins)
12V_EXP: 3_POWER SWITCH AND LDO (9 pins), 4_COMMUNICATION (J1#2.1 J2.1), 5_CURRENT_SOURCE (10 pins), 6_SWITCHING (8 pins)
GND: 3_POWER SWITCH AND LDO (31 pins), 4_COMMUNICATION (15 pins), 5_CURRENT_SOURCE (34 pins), 6_SWITCHING (79 pins), MOUNTING (8 pins)
I_LD_EXT: 5_CURRENT_SOURCE (R35.1), 6_SWITCHING (8 pins)
I_LD_INT: 5_CURRENT_SOURCE (R20.1), 6_SWITCHING (24 pins)
DAC_CS: 4_COMMUNICATION (D7.2 J1#2.6), 5_CURRENT_SOURCE (R8.2 U2.3)
EXT_LASER_DAC: 4_COMMUNICATION (D9#2.1 D9#2.2 J2.11), 5_CURRENT_SOURCE (C40.1 R26.2)
EXT_LASER_DAC_LATCH: 4_COMMUNICATION (D34#2.1 J2.7), 5_CURRENT_SOURCE (R47.1 U12.8)
EXT_LASER_DAC_nCS: 4_COMMUNICATION (D35#2.2 J2.6), 5_CURRENT_SOURCE (R45.2 U12.3)
EXT_LASER_SPI_MOSI: 4_COMMUNICATION (D44.1 J2.3), 5_CURRENT_SOURCE (U12.5), 6_SWITCHING (TP10.1 U3.3)
EXT_LASER_SPI_SCK: 4_COMMUNICATION (D35#2.1 J2.5), 5_CURRENT_SOURCE (U12.4), 6_SWITCHING (TP11.1 U3.1)
I_MO_INT: 4_COMMUNICATION (D5.2 J1#2.10), 5_CURRENT_SOURCE (C19.1 R9.2)
LATCH: 4_COMMUNICATION (D6.1 J1#2.7), 5_CURRENT_SOURCE (R13.1 U2.8)
MOSI_LD: 4_COMMUNICATION (D8.1 J1#2.3 TP2.1), 5_CURRENT_SOURCE (U2.5), 6_SWITCHING (U8.3)
SCK_LD: 4_COMMUNICATION (D7.1 J1#2.5 TP4.1), 5_CURRENT_SOURCE (U2.4), 6_SWITCHING (U8.1 U9.1 U10.1)
SW_EXT_CS: 4_COMMUNICATION (D5.1 J1#2.9 TP6.1), 6_SWITCHING (TP12.1 U3.24)
SW_INT_CS: 4_COMMUNICATION (D6.2 J1#2.8 TP5.1), 6_SWITCHING (U8.24 U9.24 U10.24)